# Altium project PCB_GREAT.PrjPCB
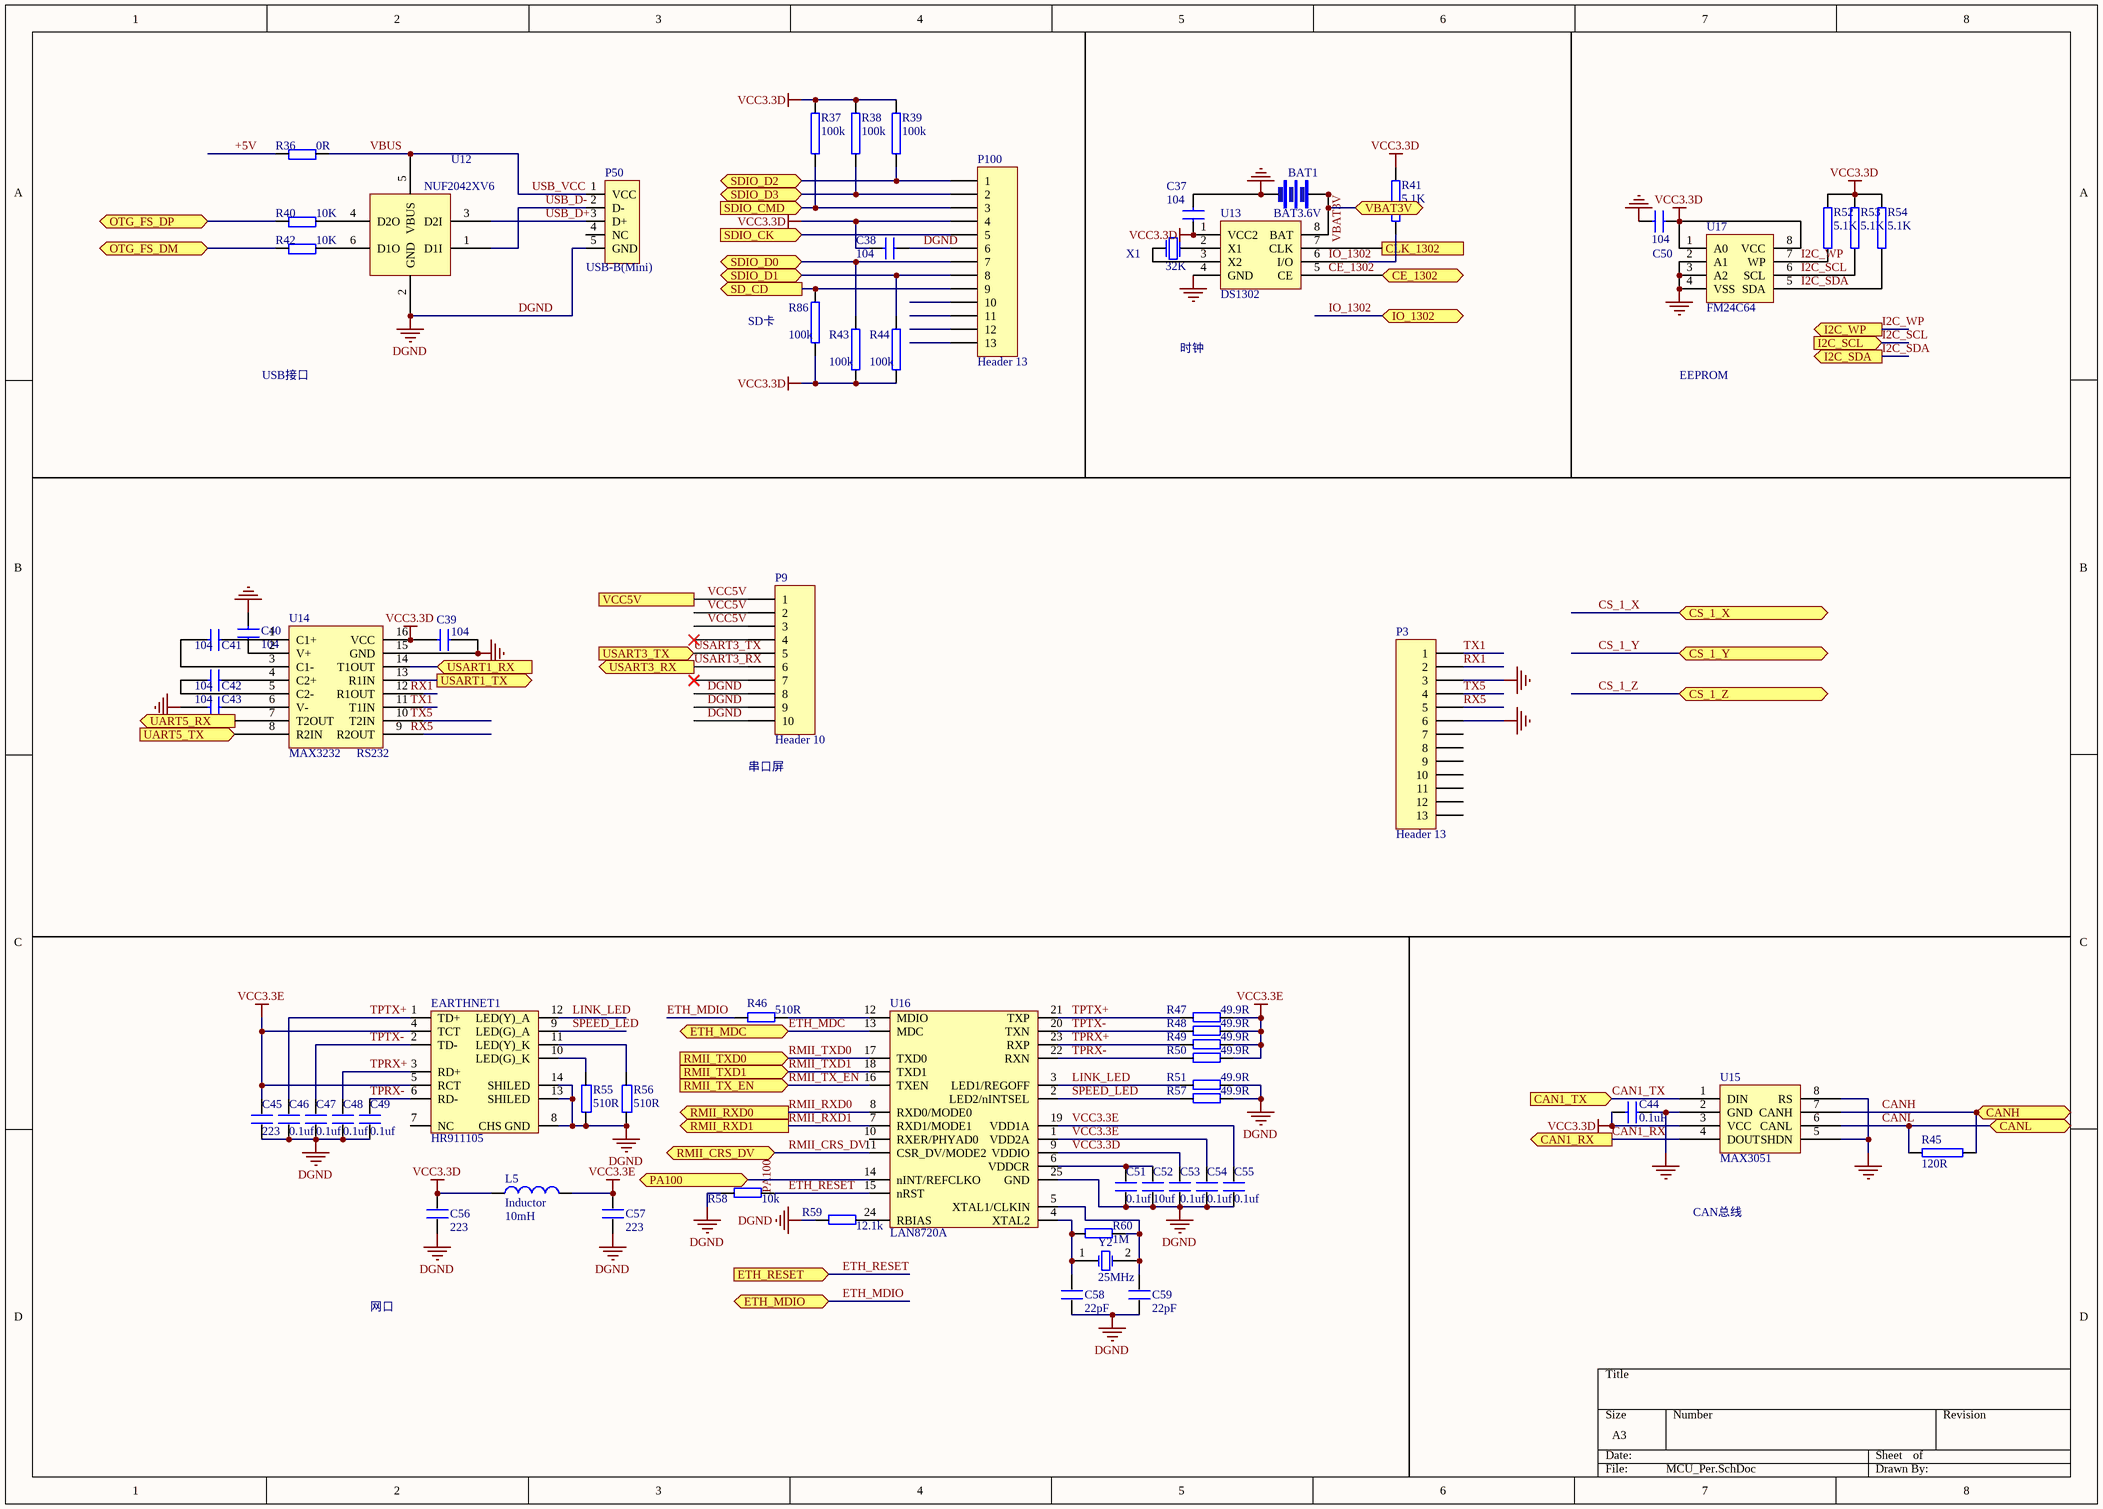
[diagram p0: MCU_Per.SchDoc]
4 sheets, 188 parts. Net scope: flat (ports and power ports of the same name join across sheets).
Board file: F_300.PcbDoc
Sheets:
  MCU_Per.SchDoc
  MCU_H.SchDoc
  IO_IIC.SchDoc
  Power.SchDoc

## Sheet MCU_Per.SchDoc
size A3

### Parts
BAT1  BAT3.6V  [BAT]
C37  104  [0603]
C38  104  [0603]
C39  104  [0603]
C40  104  [0603]
C41  104  [0603]
C42  104  [0603]
C43  104  [0603]
C44  0.1uF  [0603]
C45  223  [0603P]
C46  0.1uf  [0603P]
C47  0.1uf  [0603P]
C48  0.1uf  [0603P]
C49  0.1uf  [0603P]
C50  104  [0603]
C51  0.1uf  [0603P]
C52  10uf  [0603P]
C53  0.1uf  [0603P]
C54  0.1uf  [0603P]
C55  0.1uf  [0603P]
C56  223  [0603P]
C57  223  [0603P]
C58  22pF  [0603P]
C59  22pF  [0603P]
EARTHNET1  HR911105  [HR911105A]
L5  Inductor  value 10mH  [0805]
P3  Header 13  [HDR1X6]
P9  Header 10  [PCBComponent_1]
P50  USB-B(Mini)  [USB/SM0.8-6H5]
P100  Header 13  [SD-SMT]
R36  0R  [0603P]
R37  100k  [0603]
R38  100k  [0603]
R39  100k  [0603]
R40  10K  [0603P]
R41  5.1K  [0603]
R42  10K  [0603P]
R43  100k  [0603]
R44  100k  [0603]
R45  120R  [0603]
R46  510R  [0603P]
R47  49.9R  [0603P]
R48  49.9R  [0603P]
R49  49.9R  [0603P]
R50  49.9R  [0603P]
R51  49.9R  [0603P]
R52  5.1K  [0603]
R53  5.1K  [0603]
R54  5.1K  [0603]
R55  510R  [0603P]
R56  510R  [0603P]
R57  49.9R  [0603P]
R58  10k  [0603P]
R59  12.1k  [0603P]
R60  1M  [0603P]
R86  100k  [0603]
U12  NUF2042XV6  [NUF2042XV6]
U13  DS1302  [SO-8]
U14  MAX3232  [SO-16]
U15  MAX3051  [SO-8]
U16  LAN8720A  [LAN7820A-QFN24]
U17  FM24C64  [SO-8]
X1  32K  [XTAL-2]
Y2  25MHz  [XTAL_US]

### Ports
CAN1_RX (out), CAN1_TX (in), CANH, CANL, CE_1302 (bidir), CLK_1302, CS_1_X, CS_1_Y, CS_1_Z, ETH_MDC (bidir), ETH_MDIO (bidir), ETH_RESET (in), I2C_SCL (in), I2C_SDA (out), I2C_WP (out), IO_1302 (bidir), OTG_FS_DM (bidir), OTG_FS_DP (bidir), PA100, RMII_CRS_DV (bidir), RMII_RXD0 (out), RMII_RXD1 (out), RMII_TX_EN (in), RMII_TXD0 (in), RMII_TXD1 (in), SD_CD (out), SDIO_CK (in), SDIO_CMD (in), SDIO_D0 (bidir), SDIO_D1 (bidir), SDIO_D2 (bidir), SDIO_D3 (bidir), UART5_RX (out), UART5_TX (in), USART1_RX (in), USART1_TX (out), USART3_RX (out), USART3_TX (in), VBAT3V, VCC5V

### Nets
DGND: BAT1.2 C37.1 C38.1 C39.1 C40.1 C43.2 C44.1 C45.2 C46.2 C47.2 C48.2 C49.2 C50.2 C51.2 C52.2 C53.2 C54.2 C55.2 C56.2 C57.2 C58.2 C59.2 EARTHNET1.8(CHS_GND) EARTHNET1.13(SHILED) EARTHNET1.14(SHILED) P3.3 P3.6 P9.8 P9.9 P9.10 P50.5(GND) P100.6 R51.1 R55.1 R56.1 R57.1 R58.2 R59.2 U12.2(GND) U13.4(GND) U14.15(GND) U15.2(GND) U15.5(SHDN) U15.8(RS) U16.25(GND) U17.2(A1) U17.3(A2) U17.4(VSS)
VCC3.3D: C37.2 C38.2 C39.2 C44.2 C50.1 C53.1 C56.1 L5.1 P100.4 R37.1 R38.1 R39.1 R41.2 R43.2 R44.2 R52.2 R53.2 R54.2 R86.2 U13.1(VCC2) U14.16(VCC) U15.3(VCC) U16.9(VDDIO) U17.1(A0) U17.8(VCC)
VCC3.3E: C45.1 C54.1 C55.1 C57.1 EARTHNET1.4(TCT) EARTHNET1.5(RCT) L5.2 R47.1 R48.1 R49.1 R50.1 U16.1(VDD2A) U16.19(VDD1A)
+5V: R36.1
CAN1_RX: U15.4(DOUT) ; port CAN1_RX
CAN1_TX: U15.1(DIN) ; port CAN1_TX
CANH: R45.1 U15.7(CANH) ; port CANH
CANL: R45.2 U15.6(CANL) ; port CANL
CE_1302: U13.5(CE) ; port CE_1302
ETH_MDC: U16.13(MDC) ; port ETH_MDC
ETH_MDIO: R46.2 ; port ETH_MDIO
ETH_RESET: R58.1 U16.15(nRST) ; port ETH_RESET  [also labelled PA100]
I2C_SCL: R53.1 U17.6(SCL) ; port I2C_SCL
I2C_SDA: R54.1 U17.5(SDA) ; port I2C_SDA
I2C_WP: R52.1 U17.7(WP) ; port I2C_WP
IO_1302: R41.1 U13.6(I/O) ; port IO_1302
LINK_LED: EARTHNET1.12(LED(Y)_A) R51.2 U16.3(LED1/REGOFF)
PA9: U14.13(R1IN) ; port USART1_TX
PA11: R42.1 ; port OTG_FS_DM
PA12: R40.1 ; port OTG_FS_DP
PA100: U16.14(nINT/REFCLKO) ; port PA100
PB12: U14.8(R2IN) ; port UART5_TX
PB13: U14.7(T2OUT) ; port UART5_RX
PB15: U14.14(T1OUT) ; port USART1_RX
PC8: P100.7 R43.1 ; port SDIO_D0
PC9: P100.8 R44.1 ; port SDIO_D1
PC10: P100.1 R39.2 ; port SDIO_D2
PC11: P100.2 R38.2 ; port SDIO_D3
PC12: P100.5 ; port SDIO_CK
PD2: P100.3 R37.2 ; port SDIO_CMD
PH6: U13.7(CLK) ; port CLK_1302
RMII_CRS_DV: U16.11(CSR_DV/MODE2) ; port RMII_CRS_DV  [project net PA7]
RMII_RXD0: U16.8(RXD0/MODE0) ; port RMII_RXD0  [project net PC4]
RMII_RXD1: U16.7(RXD1/MODE1) ; port RMII_RXD1  [project net PC5]
RMII_TX_EN: U16.16(TXEN) ; port RMII_TX_EN  [project net PG11]
RMII_TXD0: U16.17(TXD0) ; port RMII_TXD0  [project net PG13]
RMII_TXD1: U16.18(TXD1) ; port RMII_TXD1  [project net PG14]
RX1: P3.2 U14.12(R1OUT)
RX5: P3.5 U14.9(R2OUT)
SPEED_LED: EARTHNET1.9(LED(G)_A) R57.2 U16.2(LED2/nINTSEL)
TPRX+: C48.1 EARTHNET1.3(RD+) R49.2 U16.23(RXP)
TPRX-: C49.1 EARTHNET1.6(RD-) R50.2 U16.22(RXN)
TPTX+: C46.1 EARTHNET1.1(TD+) R47.2 U16.21(TXP)
TPTX-: C47.1 EARTHNET1.2(TD-) R48.2 U16.20(TXN)
TX1: P3.1 U14.11(T1IN)
TX5: P3.4 U14.10(T2IN)
USART3_RX: P9.6 ; port USART3_RX  [project net PB11]
USART3_TX: P9.5 ; port USART3_TX  [project net PB10]
USB_D+: P50.3(D+) U12.3(D2I)
USB_D-: P50.2(D-) U12.1(D1I)
USB_VCC: P50.1(VCC) R36.2 U12.5(VBUS)  [also labelled VBUS]
VBAT3V: BAT1.1 U13.8(BAT) ; port VBAT3V
VCC5V: P9.1 P9.2 P9.3 ; port VCC5V
NetC40_2: C40.2 U14.2(V+)
NetC41_1: C41.1 U14.1(C1+)
NetC41_2: C41.2 U14.3(C1-)
NetC42_1: C42.1 U14.4(C2+)
NetC42_2: C42.2 U14.5(C2-)
NetC43_1: C43.1 U14.6(V-)
NetC51_1: C51.1 C52.1 U16.6(VDDCR)
NetC58_1: C58.1 R60.2 U16.4(XTAL2) Y2.1(OSC1)
NetC59_1: C59.1 R60.1 U16.5(XTAL1/CLKIN) Y2.2(OSC2)
NetEARTHNET1_10: EARTHNET1.10(LED(G)_K) R55.2
NetEARTHNET1_11: EARTHNET1.11(LED(Y)_K) R56.2
NetP100_9: P100.9 R86.1 ; port SD_CD
NetR40_2: R40.2 U12.4(D2O)
NetR42_2: R42.2 U12.6(D1O)
NetR46_1: R46.1 U16.12(MDIO)
NetR59_1: R59.1 U16.24(RBIAS)
NetU13_2: U13.2(X1) X1.2(P2)
NetU13_3: U13.3(X2) X1.1(P1)

Not connected (* = marked no-connect by the designer): EARTHNET1 7(NC); P3 7 8 9 10 11 12 13; P9 4* 7*; P50 4(NC); P100 10 11 12 13; U16 10(RXER/PHYAD0)

### Notes on the sheet
- USB接口
- (near R86) SD卡
- 时钟
- EEPROM
- (near U14) RS232
- (near P9) 串口屏
- CAN总线
- 网口

### Library data of the parts
C37-C59 = C
L5 = Inductor: Code_IEC: 1005; Published: 8-Jun-2000; LatestRevisionDate: 29-May-2009; LatestRevisionNote: IPC-7351 Footprint Added.; PackageReference: 0402-A; Publisher: Altium Limited; PackageDescription: Chip Inductor; Code_JEITA: 0402
P3 P100 = Header 13: Header, 13-Pin; LatestRevisionDate: 17-Jul-2002; LatestRevisionNote: Re-released for DXP Platform.; Publisher: Altium Limited
P9 = Header 10: Header, 10-Pin; LatestRevisionDate: 17-Jul-2002; LatestRevisionNote: Re-released for DXP Platform.; Publisher: Altium Limited
P50 = USB5
R36 R40 R42 R46-R51 R55-R60 = R
R37-R39 R41 R43-R45 R52-R54 R86 = RES
U12 = NUF2042XV6: USB
U15 = MAX3051: CAN
U16 = LAN8720: ETH PHY
X1 = XTAL
Y2 = XTAL: Crystal Oscillator; Published: 8-Jun-2000; LatestRevisionDate: 17-Jul-2002; LatestRevisionNote: Re-released for DXP Platform.; PackageReference: R38; Publisher: Altium Limited; PackageDescription: Crystal, Thru-Hole; 2 Leads; Body 3.1 x 8.2 mm (Dia.xH)

## Sheet MCU_H.SchDoc
size A3
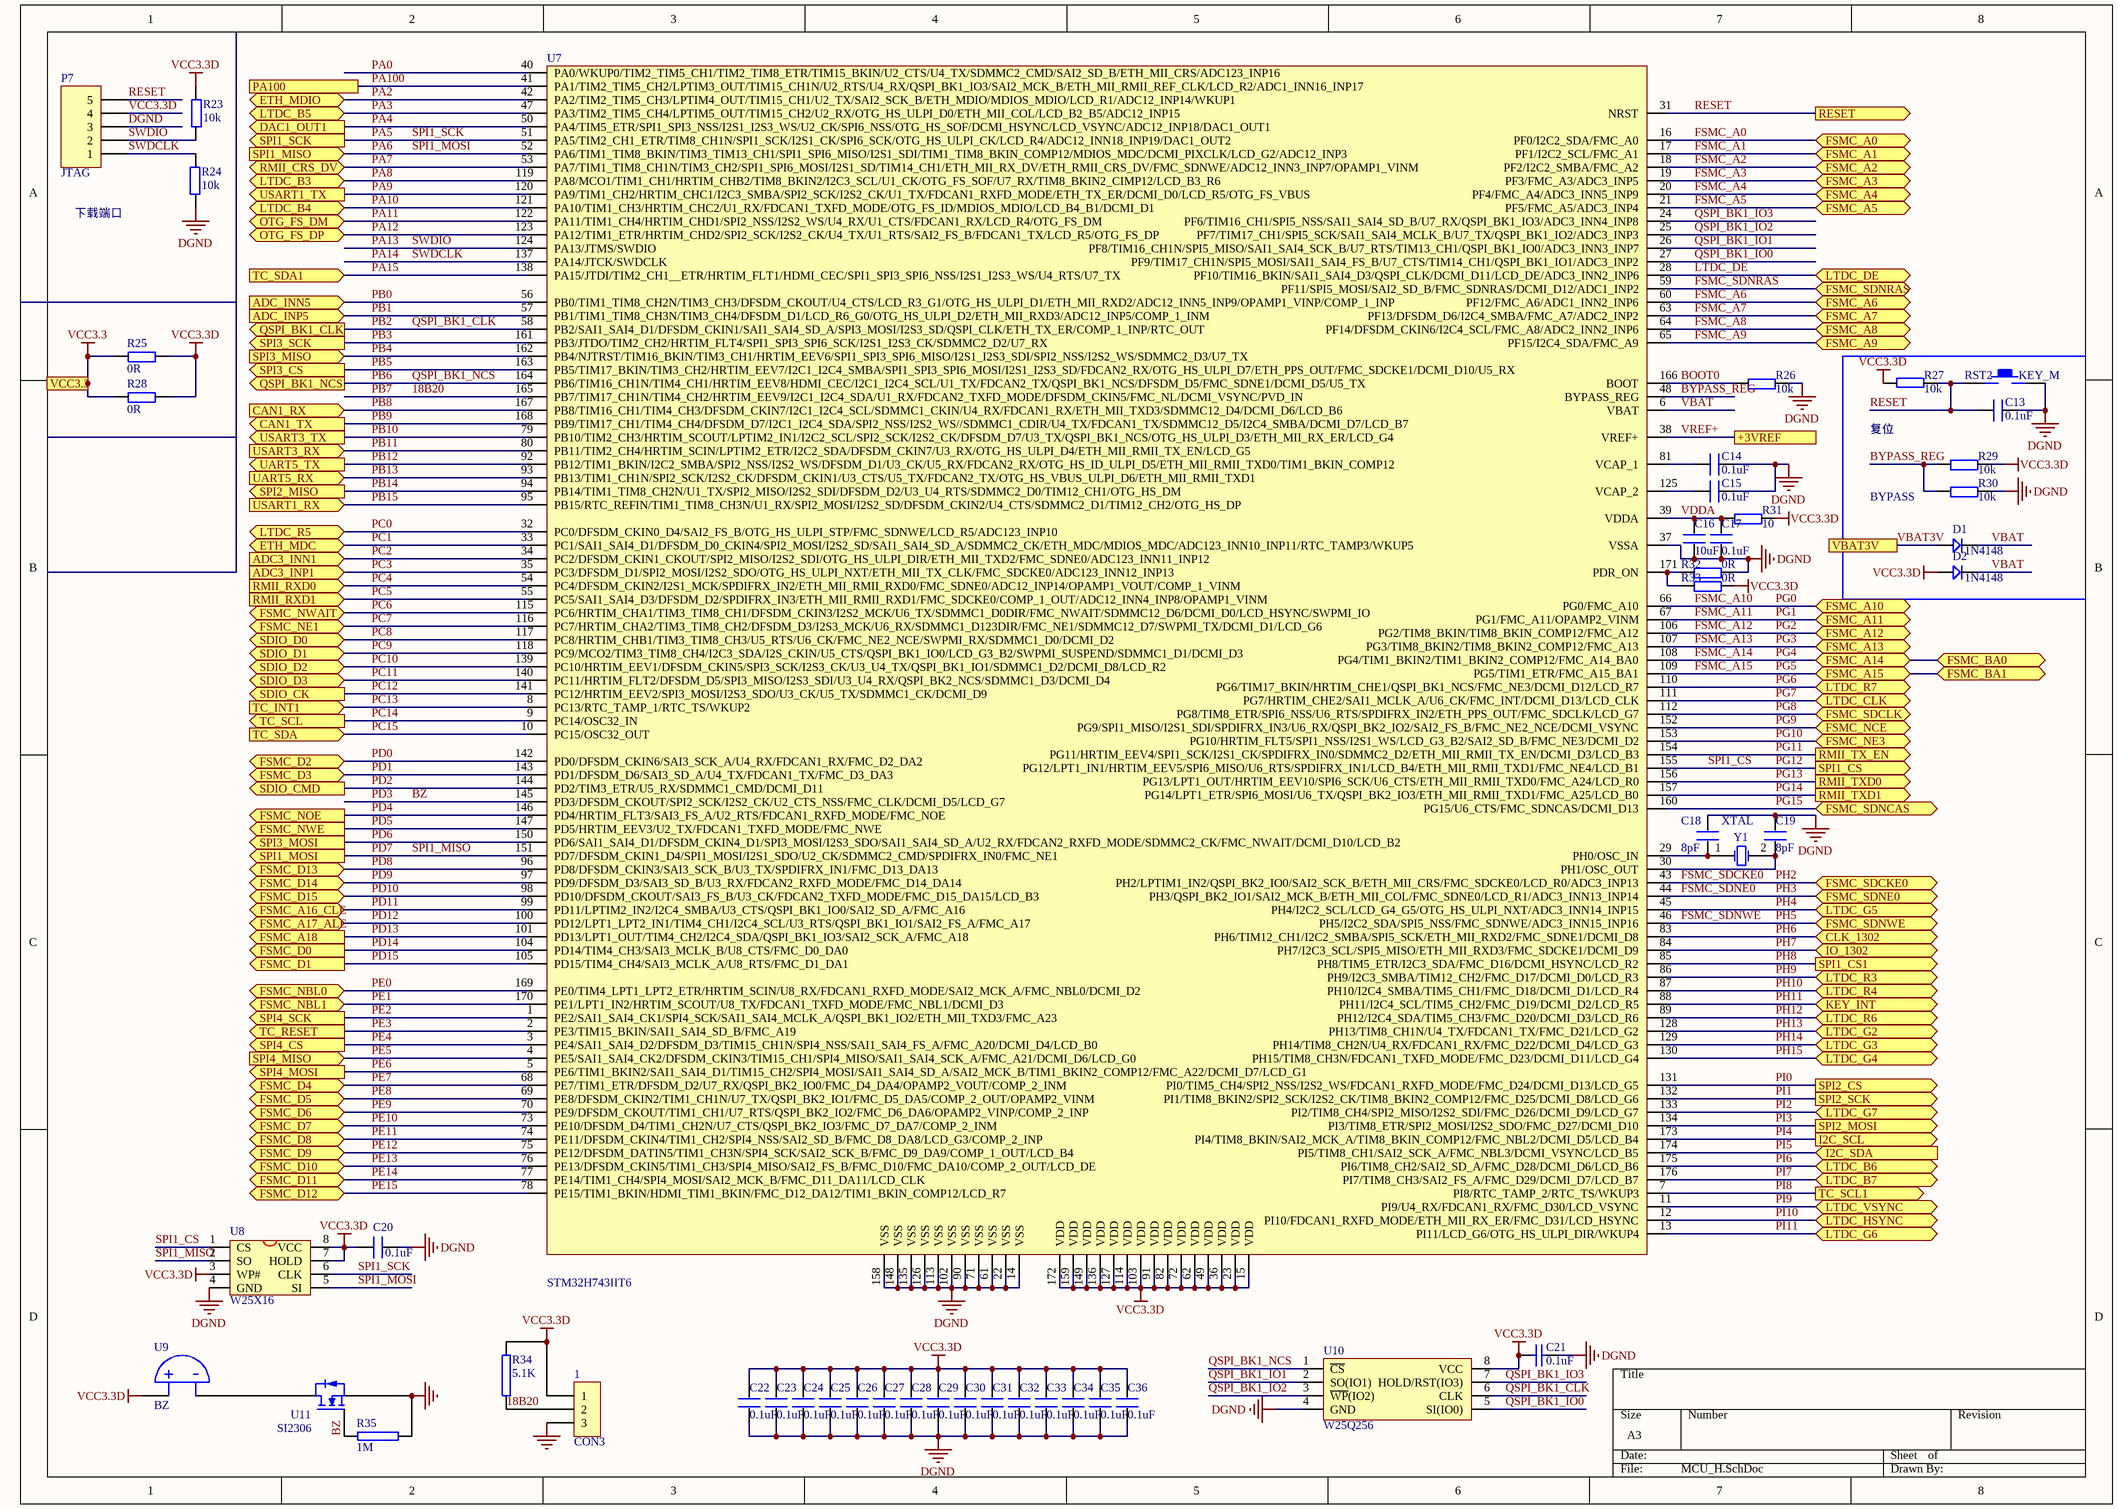
[diagram p1: MCU_H.SchDoc]

### Parts
1  CON3  [SIP3]
C13  0.1uF  [0603P]
C14  0.1uF  [0603P]
C15  0.1uF  [0603P]
C16  10uF  [0603P]
C17  0.1uF  [0603P]
C18  8pF  [0603P]
C19  8pF  [0603P]
C20  0.1uF  [0603P]
C21  0.1uF  [0603P]
C22  0.1uF  [0402]
C23  0.1uF  [0402]
C24  0.1uF  [0402]
C25  0.1uF  [0402]
C26  0.1uF  [0402]
C27  0.1uF  [0402]
C28  0.1uF  [0402]
C29  0.1uF  [0402]
C30  0.1uF  [0402]
C31  0.1uF  [0402]
C32  0.1uF  [0402]
C33  0.1uF  [0402]
C34  0.1uF  [0402]
C35  0.1uF  [0402]
C36  0.1uF  [0402]
D1  1N4148  [DIODE_SOP]
D2  1N4148  [DIODE_SOP]
P7  JTAG  [HDR1X5]
R23  10k  [0603P]
R24  10k  [0603P]
R25  0R  [0603P]
R26  10k  [0603P]
R27  10k  [0603P]
R28  0R  [0603P]
R29  10k  [0603P]
R30  10k  [0603P]
R31  10  [0603P]
R32  0R  [0603P]
R33  0R  [0603P]
R34  5.1K  [0603]
R35  1M  [0603]
RST2  KEY_M  [KEY_SOP3625]
U7  STM32H743IIT6  [STM32h743IIGT-NEW-LQFN-176N]
U8  W25X16  [SOIC-8]
U9  BZ  [BZ_SMALL]
U10  W25Q256  [WSON8]
U11  SI2306  [SOT-23]
Y1  XTAL  [XTAL1]

### Ports
+3VREF, ADC3_INN1 (in), ADC3_INP1 (in), ADC_INN5 (in), ADC_INP5 (in), CAN1_RX (in), CAN1_TX (out), CLK_1302 (bidir), DAC1_OUT1 (out), ETH_MDC (bidir), ETH_MDIO (bidir), FSMC_A0 (bidir), FSMC_A1 (bidir), FSMC_A2 (bidir), FSMC_A3 (bidir), FSMC_A4 (bidir), FSMC_A5 (bidir), FSMC_A6 (bidir), FSMC_A7 (bidir), FSMC_A8 (bidir), FSMC_A9 (bidir), FSMC_A10 (bidir), FSMC_A11 (bidir), FSMC_A12 (bidir), FSMC_A13 (bidir), FSMC_A14 (bidir), FSMC_A15 (bidir), FSMC_A16_CLE (bidir), FSMC_A17_ALE (bidir), FSMC_A18 (out), FSMC_BA0 (bidir), FSMC_BA1 (bidir), FSMC_D0 (out), FSMC_D1 (out), FSMC_D2 (bidir), FSMC_D3 (bidir), FSMC_D4 (bidir), FSMC_D5 (bidir), FSMC_D6 (bidir), FSMC_D7 (bidir), FSMC_D8 (bidir), FSMC_D9 (bidir), FSMC_D10 (bidir), FSMC_D11 (bidir), FSMC_D12 (bidir), FSMC_D13 (bidir), FSMC_D14 (bidir), FSMC_D15 (bidir), FSMC_NBL0 (bidir), FSMC_NBL1 (bidir), FSMC_NCE (bidir), FSMC_NE1 (bidir), FSMC_NE3 (bidir), FSMC_NOE (out), FSMC_NWAIT (bidir), FSMC_NWE (out), FSMC_SDCKE0 (bidir), FSMC_SDCLK (bidir), FSMC_SDNCAS (bidir), FSMC_SDNE0 (bidir), FSMC_SDNRAS (bidir), FSMC_SDNWE (bidir), I2C_SCL (out), I2C_SDA (in), IO_1302 (bidir), KEY_INT (bidir), LTDC_B3 (bidir), LTDC_B4 (bidir), LTDC_B5 (bidir), LTDC_B6 (bidir), LTDC_B7 (bidir), LTDC_CLK (bidir), LTDC_DE (bidir), LTDC_G2 (bidir), LTDC_G3 (bidir), LTDC_G4 (bidir), LTDC_G5 (bidir), LTDC_G6 (bidir), LTDC_G7 (bidir), LTDC_HSYNC (bidir), LTDC_R3 (bidir), LTDC_R4 (bidir), LTDC_R5 (bidir), LTDC_R6 (bidir), LTDC_R7 (bidir), LTDC_VSYNC (bidir), OTG_FS_DM (bidir), OTG_FS_DP (bidir), PA100, QSPI_BK1_CLK (out), QSPI_BK1_NCS (out), RESET (out), RMII_CRS_DV (bidir), RMII_RXD0 (in), RMII_RXD1 (in), RMII_TX_EN (out), RMII_TXD0 (out), RMII_TXD1 (out), SDIO_CK (out), SDIO_CMD (out), SDIO_D0 (bidir), SDIO_D1 (bidir), SDIO_D2 (bidir), SDIO_D3 (bidir), SPI1_CS1 (out), SPI1_CS (out), SPI1_MISO (in), SPI1_MOSI (out), SPI1_SCK (out), SPI2_CS (out), SPI2_MISO (out), SPI2_MOSI (out), SPI2_SCK (out), SPI3_CS (out), SPI3_MISO (in), SPI3_MOSI (out), SPI3_SCK (out), SPI4_CS (out), SPI4_MISO (in), SPI4_MOSI (out), SPI4_SCK (out), TC_INT1 (in), TC_RESET (out), TC_SCL1 (out), TC_SCL (out), TC_SDA1 (in), TC_SDA (in), UART5_RX (in), UART5_TX (out), USART1_RX (in), USART1_TX (out), USART3_RX (in), USART3_TX (out), VBAT3V, VCC3.3

### Nets
DGND: 1.3 C13.2 C14.2 C15.2 C16.1 C17.1 C18.2 C19.2 C20.2 C21.1 C22.1 C23.1 C24.1 C25.1 C26.1 C27.1 C28.1 C29.1 C30.1 C31.1 C32.1 C33.1 C34.1 C35.1 C36.1 P7.3 R24.2 R26.2 R30.2 R32.2 R35.1 RST2.2 U7.14(VSS) U7.22(VSS) U7.37(VSSA) U7.61(VSS) U7.71(VSS) U7.90(VSS) U7.102(VSS) U7.113(VSS) U7.126(VSS) U7.135(VSS) U7.148(VSS) U7.158(VSS) U8.4(GND) U10.4(GND) U11.E
VCC3.3: R25.1 R28.1 ; port VCC3.3
VCC3.3D: 1.1 C20.1 C21.2 C22.2 C23.2 C24.2 C25.2 C26.2 C27.2 C28.2 C29.2 C30.2 C31.2 C32.2 C33.2 C34.2 C35.2 C36.2 D2.1 P7.4 R23.2 R25.2 R27.2 R28.2 R29.2 R31.2 R33.2 R34.2 U7.15(VDD) U7.23(VDD) U7.36(VDD) U7.49(VDD) U7.62(VDD) U7.72(VDD) U7.82(VDD) U7.91(VDD) U7.103(VDD) U7.114(VDD) U7.127(VDD) U7.136(VDD) U7.149(VDD) U7.159(VDD) U7.172(VDD) U8.3(WP#) U8.7(HOLD) U8.8(VCC) U9.1 U10.8(VCC)
VREF+: U7.38(VREF+) ; port +3VREF
18B20: 1.2 R34.1 U7.165(PB7/TIM17_CH1N/TIM4_CH2/HRTIM_EEV9/I2C1_I2C4_SDA/U1_RX/FDCAN2_TXFD_MODE/DFSDM_CKIN5/FMC_NL/DCMI_VSYNC/PVD_IN)  [also labelled PB7]
BOOT0: R26.1 U7.166(BOOT)
BYPASS_REG: R29.1 R30.1 U7.48(BYPASS_REG)
BZ: R35.2 U7.145(PD3/DFSDM_CKOUT/SPI2_SCK/I2S2_CK/U2_CTS_NSS/FMC_CLK/DCMI_D5/LCD_G7) U11.B  [also labelled PD3]
FSMC_A0: U7.16(PF0/I2C2_SDA/FMC_A0) ; port FSMC_A0
FSMC_A1: U7.17(PF1/I2C2_SCL/FMC_A1) ; port FSMC_A1
FSMC_A2: U7.18(PF2/I2C2_SMBA/FMC_A2) ; port FSMC_A2
FSMC_A3: U7.19(PF3/FMC_A3/ADC3_INP5) ; port FSMC_A3
FSMC_A4: U7.20(PF4/FMC_A4/ADC3_INN5_INP9) ; port FSMC_A4
FSMC_A5: U7.21(PF5/FMC_A5/ADC3_INP4) ; port FSMC_A5
FSMC_A6: U7.60(PF12/FMC_A6/ADC1_INN2_INP6) ; port FSMC_A6
FSMC_A7: U7.63(PF13/DFSDM_D6/I2C4_SMBA/FMC_A7/ADC2_INP2) ; port FSMC_A7
FSMC_A8: U7.64(PF14/DFSDM_CKIN6/I2C4_SCL/FMC_A8/ADC2_INN2_INP6) ; port FSMC_A8
FSMC_A9: U7.65(PF15/I2C4_SDA/FMC_A9) ; port FSMC_A9
FSMC_A10: U7.66(PG0/FMC_A10) ; port FSMC_A10  [also labelled PG0]
FSMC_A11: U7.67(PG1/FMC_A11/OPAMP2_VINM) ; port FSMC_A11  [also labelled PG1]
FSMC_A12: U7.106(PG2/TIM8_BKIN/TIM8_BKIN_COMP12/FMC_A12) ; port FSMC_A12  [also labelled PG2]
FSMC_A13: U7.107(PG3/TIM8_BKIN2/TIM8_BKIN2_COMP12/FMC_A13) ; port FSMC_A13  [also labelled PG3]
FSMC_A14: U7.108(PG4/TIM1_BKIN2/TIM1_BKIN2_COMP12/FMC_A14_BA0) ; port FSMC_A14, port FSMC_BA0  [also labelled PG4]
FSMC_A15: U7.109(PG5/TIM1_ETR/FMC_A15_BA1) ; port FSMC_A15, port FSMC_BA1  [also labelled PG5]
FSMC_SDCKE0: U7.43(PH2/LPTIM1_IN2/QSPI_BK2_IO0/SAI2_SCK_B/ETH_MII_CRS/FMC_SDCKE0/LCD_R0/ADC3_INP13) ; port FSMC_SDCKE0  [also labelled PH2]
FSMC_SDNE0: U7.44(PH3/QSPI_BK2_IO1/SAI2_MCK_B/ETH_MII_COL/FMC_SDNE0/LCD_R1/ADC3_INN13_INP14) ; port FSMC_SDNE0  [also labelled PH3]
FSMC_SDNRAS: U7.59(PF11/SPI5_MOSI/SAI2_SD_B/FMC_SDNRAS/DCMI_D12/ADC1_INP2) ; port FSMC_SDNRAS
FSMC_SDNWE: U7.46(PH5/I2C2_SDA/SPI5_NSS/FMC_SDNWE/ADC3_INN15_INP16) ; port FSMC_SDNWE  [also labelled PH5]
LTDC_DE: U7.28(PF10/TIM16_BKIN/SAI1_SAI4_D3/QSPI_CLK/DCMI_D11/LCD_DE/ADC3_INN2_INP6) ; port LTDC_DE
PA0: U7.40(PA0/WKUP0/TIM2_TIM5_CH1/TIM2_TIM8_ETR/TIM15_BKIN/U2_CTS/U4_TX/SDMMC2_CMD/SAI2_SD_B/ETH_MII_CRS/ADC123_INP16)
PA2: U7.42(PA2/TIM2_TIM5_CH3/LPTIM4_OUT/TIM15_CH1/U2_TX/SAI2_SCK_B/ETH_MDIO/MDIOS_MDIO/LCD_R1/ADC12_INP14/WKUP1) ; port ETH_MDIO  [project net ETH_MDIO]
PA3: U7.47(PA3/TIM2_TIM5_CH4/LPTIM5_OUT/TIM15_CH2/U2_RX/OTG_HS_ULPI_D0/ETH_MII_COL/LCD_B2_B5/ADC12_INP15) ; port LTDC_B5
PA4: U7.50(PA4/TIM5_ETR/SPI1_SPI3_NSS/I2S1_I2S3_WS/U2_CK/SPI6_NSS/OTG_HS_SOF/DCMI_HSYNC/LCD_VSYNC/ADC12_INP18/DAC1_OUT1) ; port DAC1_OUT1  [project net DAC1_OUT1]
PA5: U7.51(PA5/TIM2_CH1_ETR/TIM8_CH1N/SPI1_SCK/I2S1_CK/SPI6_SCK/OTG_HS_ULPI_CK/LCD_R4/ADC12_INN18_INP19/DAC1_OUT2) U8.6(CLK) ; port SPI1_SCK  [also labelled SPI1_SCK]
PA6: U7.52(PA6/TIM1_TIM8_BKIN/TIM3_TIM13_CH1/SPI1_SPI6_MISO/I2S1_SDI/TIM1_TIM8_BKIN_COMP12/MDIOS_MDC/DCMI_PIXCLK/LCD_G2/ADC12_INP3) U8.5(SI) ; port SPI1_MISO  [also labelled SPI1_MOSI]
PA7: U7.53(PA7/TIM1_TIM8_CH1N/TIM3_CH2/SPI1_SPI6_MOSI/I2S1_SD/TIM14_CH1/ETH_MII_RX_DV/ETH_RMII_CRS_DV/FMC_SDNWE/ADC12_INN3_INP7/OPAMP1_VINM) ; port RMII_CRS_DV
PA8: U7.119(PA8/MCO1/TIM1_CH1/HRTIM_CHB2/TIM8_BKIN2/I2C3_SCL/U1_CK/OTG_FS_SOF/U7_RX/TIM8_BKIN2_CIMP12/LCD_B3_R6) ; port LTDC_B3
PA9: U7.120(PA9/TIM1_CH2/HRTIM_CHC1/I2C3_SMBA/SPI2_SCK/I2S2_CK/U1_TX/FDCAN1_RXFD_MODE/ETH_TX_ER/DCMI_D0/LCD_R5/OTG_FS_VBUS) ; port USART1_TX
PA10: U7.121(PA10/TIM1_CH3/HRTIM_CHC2/U1_RX/FDCAN1_TXFD_MODE/OTG_FS_ID/MDIOS_MDIO/LCD_B4_B1/DCMI_D1) ; port LTDC_B4
PA11: U7.122(PA11/TIM1_CH4/HRTIM_CHD1/SPI2_NSS/I2S2_WS/U4_RX/U1_CTS/FDCAN1_RX/LCD_R4/OTG_FS_DM) ; port OTG_FS_DM
PA12: U7.123(PA12/TIM1_ETR/HRTIM_CHD2/SPI2_SCK/I2S2_CK/U4_TX/U1_RTS/SAI2_FS_B/FDCAN1_TX/LCD_R5/OTG_FS_DP) ; port OTG_FS_DP
PA13: P7.2 R23.1 U7.124(PA13/JTMS/SWDIO)  [also labelled SWDIO]
PA14: P7.1 R24.1 U7.137(PA14/JTCK/SWDCLK)  [also labelled SWDCLK]
PA15: U7.138(PA15/JTDI/TIM2_CH1__ETR/HRTIM_FLT1/HDMI_CEC/SPI1_SPI3_SPI6_NSS/I2S1_I2S3_WS/U4_RTS/U7_TX) ; port TC_SDA1
PA100: U7.41(PA1/TIM2_TIM5_CH2/LPTIM3_OUT/TIM15_CH1N/U2_RTS/U4_RX/QSPI_BK1_IO3/SAI2_MCK_B/ETH_MII_RMII_REF_CLK/LCD_R2/ADC1_INN16_INP17) ; port PA100
PB0: U7.56(PB0/TIM1_TIM8_CH2N/TIM3_CH3/DFSDM_CKOUT/U4_CTS/LCD_R3_G1/OTG_HS_ULPI_D1/ETH_MII_RXD2/ADC12_INN5_INP9/OPAMP1_VINP/COMP_1_INP) ; port ADC_INN5
PB1: U7.57(PB1/TIM1_TIM8_CH3N/TIM3_CH4/DFSDM_D1/LCD_R6_G0/OTG_HS_ULPI_D2/ETH_MII_RXD3/ADC12_INP5/COMP_1_INM) ; port ADC_INP5
PB2: U7.58(PB2/SAI1_SAI4_D1/DFSDM_CKIN1/SAI1_SAI4_SD_A/SPI3_MOSI/I2S3_SD/QSPI_CLK/ETH_TX_ER/COMP_1_INP/RTC_OUT) U10.6(CLK) ; port QSPI_BK1_CLK  [also labelled QSPI_BK1_CLK]
PB3: U7.161(PB3/JTDO/TIM2_CH2/HRTIM_FLT4/SPI1_SPI3_SPI6_SCK/I2S1_I2S3_CK/SDMMC2_D2/U7_RX) ; port SPI3_SCK
PB4: U7.162(PB4/NJTRST/TIM16_BKIN/TIM3_CH1/HRTIM_EEV6/SPI1_SPI3_SPI6_MISO/I2S1_I2S3_SDI/SPI2_NSS/I2S2_WS/SDMMC2_D3/U7_TX) ; port SPI3_MISO
PB5: U7.163(PB5/TIM17_BKIN/TIM3_CH2/HRTIM_EEV7/I2C1_I2C4_SMBA/SPI1_SPI3_SPI6_MOSI/I2S1_I2S3_SD/FDCAN2_RX/OTG_HS_ULPI_D7/ETH_PPS_OUT/FMC_SDCKE1/DCMI_D10/U5_RX) ; port SPI3_CS
PB6: U7.164(PB6/TIM16_CH1N/TIM4_CH1/HRTIM_EEV8/HDMI_CEC/I2C1_I2C4_SCL/U1_TX/FDCAN2_TX/QSPI_BK1_NCS/DFSDM_D5/FMC_SDNE1/DCMI_D5/U5_TX) U10.1(~{CS}) ; port QSPI_BK1_NCS  [also labelled QSPI_BK1_NCS]
PB8: U7.167(PB8/TIM16_CH1/TIM4_CH3/DFSDM_CKIN7/I2C1_I2C4_SCL/SDMMC1_CKIN/U4_RX/FDCAN1_RX/ETH_MII_TXD3/SDMMC12_D4/DCMI_D6/LCD_B6) ; port CAN1_RX  [project net CAN1_RX]
PB9: U7.168(PB9/TIM17_CH1/TIM4_CH4/DFSDM_D7/I2C1_I2C4_SDA/SPI2_NSS/I2S2_WS//SDMMC1_CDIR/U4_TX/FDCAN1_TX/SDMMC12_D5/I2C4_SMBA/DCMI_D7/LCD_B7) ; port CAN1_TX  [project net CAN1_TX]
PB10: U7.79(PB10/TIM2_CH3/HRTIM_SCOUT/LPTIM2_IN1/I2C2_SCL/SPI2_SCK/I2S2_CK/DFSDM_D7/U3_TX/QSPI_BK1_NCS/OTG_HS_ULPI_D3/ETH_MII_RX_ER/LCD_G4) ; port USART3_TX
PB11: U7.80(PB11/TIM2_CH4/HRTIM_SCIN/LPTIM2_ETR/I2C2_SDA/DFSDM_CKIN7/U3_RX/OTG_HS_ULPI_D4/ETH_MII_RMII_TX_EN/LCD_G5) ; port USART3_RX
PB12: U7.92(PB12/TIM1_BKIN/I2C2_SMBA/SPI2_NSS/I2S2_WS/DFSDM_D1/U3_CK/U5_RX/FDCAN2_RX/OTG_HS_ID_ULPI_D5/ETH_MII_RMII_TXD0/TIM1_BKIN_COMP12) ; port UART5_TX
PB13: U7.93(PB13/TIM1_CH1N/SPI2_SCK/I2S2_CK/DFSDM_CKIN1/U3_CTS/U5_TX/FDCAN2_TX/OTG_HS_VBUS_ULPI_D6/ETH_MII_RMII_TXD1) ; port UART5_RX
PB14: U7.94(PB14/TIM1_TIM8_CH2N/U1_TX/SPI2_MISO/I2S2_SDI/DFSDM_D2/U3_U4_RTS/SDMMC2_D0/TIM12_CH1/OTG_HS_DM) ; port SPI2_MISO
PB15: U7.95(PB15/RTC_REFIN/TIM1_TIM8_CH3N/U1_RX/SPI2_MOSI/I2S2_SD/DFSDM_CKIN2/U4_CTS/SDMMC2_D1/TIM12_CH2/OTG_HS_DP) ; port USART1_RX
PC0: U7.32(PC0/DFSDM_CKIN0_D4/SAI2_FS_B/OTG_HS_ULPI_STP/FMC_SDNWE/LCD_R5/ADC123_INP10) ; port LTDC_R5
PC1: U7.33(PC1/SAI1_SAI4_D1/DFSDM_D0_CKIN4/SPI2_MOSI/I2S2_SD/SAI1_SAI4_SD_A/SDMMC2_CK/ETH_MDC/MDIOS_MDC/ADC123_INN10_INP11/RTC_TAMP3/WKUP5) ; port ETH_MDC  [project net ETH_MDC]
PC2: U7.34(PC2/DFSDM_CKIN1_CKOUT/SPI2_MISO/I2S2_SDI/OTG_HS_ULPI_DIR/ETH_MII_TXD2/FMC_SDNE0/ADC123_INN11_INP12) ; port ADC3_INN1
PC3: U7.35(PC3/DFSDM_D1/SPI2_MOSI/I2S2_SDO/OTG_HS_ULPI_NXT/ETH_MII_TX_CLK/FMC_SDCKE0/ADC123_INN12_INP13) ; port ADC3_INP1
PC4: U7.54(PC4/DFSDM_CKIN2/I2S1_MCK/SPDIFRX_IN2/ETH_MII_RMII_RXD0/FMC_SDNE0/ADC12_INP14/OPAMP1_VOUT/COMP_1_VINM) ; port RMII_RXD0
PC5: U7.55(PC5/SAI1_SAI4_D3/DFSDM_D2/SPDIFRX_IN3/ETH_MII_RMII_RXD1/FMC_SDCKE0/COMP_1_OUT/ADC12_INN4_INP8/OPAMP1_VINM) ; port RMII_RXD1
PC6: U7.115(PC6/HRTIM_CHA1/TIM3_TIM8_CH1/DFSDM_CKIN3/I2S2_MCK/U6_TX/SDMMC1_D0DIR/FMC_NWAIT/SDMMC12_D6/DCMI_D0/LCD_HSYNC/SWPMI_IO) ; port FSMC_NWAIT
PC7: U7.116(PC7/HRTIM_CHA2/TIM3_TIM8_CH2/DFSDM_D3/I2S3_MCK/U6_RX/SDMMC1_D123DIR/FMC_NE1/SDMMC12_D7/SWPMI_TX/DCMI_D1/LCD_G6) ; port FSMC_NE1
PC8: U7.117(PC8/HRTIM_CHB1/TIM3_TIM8_CH3/U5_RTS/U6_CK/FMC_NE2_NCE/SWPMI_RX/SDMMC1_D0/DCMI_D2) ; port SDIO_D0
PC9: U7.118(PC9/MCO2/TIM3_TIM8_CH4/I2C3_SDA/I2S_CKIN/U5_CTS/QSPI_BK1_IO0/LCD_G3_B2/SWPMI_SUSPEND/SDMMC1_D1/DCMI_D3) ; port SDIO_D1
PC10: U7.139(PC10/HRTIM_EEV1/DFSDM_CKIN5/SPI3_SCK/I2S3_CK/U3_U4_TX/QSPI_BK1_IO1/SDMMC1_D2/DCMI_D8/LCD_R2) ; port SDIO_D2
PC11: U7.140(PC11/HRTIM_FLT2/DFSDM_D5/SPI3_MISO/I2S3_SDI/U3_U4_RX/QSPI_BK2_NCS/SDMMC1_D3/DCMI_D4) ; port SDIO_D3
PC12: U7.141(PC12/HRTIM_EEV2/SPI3_MOSI/I2S3_SDO/U3_CK/U5_TX/SDMMC1_CK/DCMI_D9) ; port SDIO_CK
PC13: U7.8(PC13/RTC_TAMP_1/RTC_TS/WKUP2) ; port TC_INT1
PC14: U7.9(PC14/OSC32_IN) ; port TC_SCL
PC15: U7.10(PC15/OSC32_OUT) ; port TC_SDA
PD0: U7.142(PD0/DFSDM_CKIN6/SAI3_SCK_A/U4_RX/FDCAN1_RX/FMC_D2_DA2) ; port FSMC_D2
PD1: U7.143(PD1/DFSDM_D6/SAI3_SD_A/U4_TX/FDCAN1_TX/FMC_D3_DA3) ; port FSMC_D3
PD2: U7.144(PD2/TIM3_ETR/U5_RX/SDMMC1_CMD/DCMI_D11) ; port SDIO_CMD
PD4: U7.146(PD4/HRTIM_FLT3/SAI3_FS_A/U2_RTS/FDCAN1_RXFD_MODE/FMC_NOE) ; port FSMC_NOE
PD5: U7.147(PD5/HRTIM_EEV3/U2_TX/FDCAN1_TXFD_MODE/FMC_NWE) ; port FSMC_NWE
PD6: U7.150(PD6/SAI1_SAI4_D1/DFSDM_CKIN4_D1/SPI3_MOSI/I2S3_SDO/SAI1_SAI4_SD_A/U2_RX/FDCAN2_RXFD_MODE/SDMMC2_CK/FMC_NWAIT/DCMI_D10/LCD_B2) ; port SPI3_MOSI
PD7: U7.151(PD7/DFSDM_CKIN1_D4/SPI1_MOSI/I2S1_SDO/U2_CK/SDMMC2_CMD/SPDIFRX_IN0/FMC_NE1) U8.2(SO) ; port SPI1_MOSI  [also labelled SPI1_MISO]
PD8: U7.96(PD8/DFSDM_CKIN3/SAI3_SCK_B/U3_TX/SPDIFRX_IN1/FMC_D13_DA13) ; port FSMC_D13
PD9: U7.97(PD9/DFSDM_D3/SAI3_SD_B/U3_RX/FDCAN2_RXFD_MODE/FMC_D14_DA14) ; port FSMC_D14
PD10: U7.98(PD10/DFSDM_CKOUT/SAI3_FS_B/U3_CK/FDCAN2_TXFD_MODE/FMC_D15_DA15/LCD_B3) ; port FSMC_D15
PD11: U7.99(PD11/LPTIM2_IN2/I2C4_SMBA/U3_CTS/QSPI_BK1_IO0/SAI2_SD_A/FMC_A16) ; port FSMC_A16_CLE
PD12: U7.100(PD12/LPT1_LPT2_IN1/TIM4_CH1/I2C4_SCL/U3_RTS/QSPI_BK1_IO1/SAI2_FS_A/FMC_A17) ; port FSMC_A17_ALE
PD13: U7.101(PD13/LPT1_OUT/TIM4_CH2/I2C4_SDA/QSPI_BK1_IO3/SAI2_SCK_A/FMC_A18) ; port FSMC_A18
PD14: U7.104(PD14/TIM4_CH3/SAI3_MCLK_B/U8_CTS/FMC_D0_DA0) ; port FSMC_D0
PD15: U7.105(PD15/TIM4_CH4/SAI3_MCLK_A/U8_RTS/FMC_D1_DA1) ; port FSMC_D1
PE0: U7.169(PE0/TIM4_LPT1_LPT2_ETR/HRTIM_SCIN/U8_RX/FDCAN1_RXFD_MODE/SAI2_MCK_A/FMC_NBL0/DCMI_D2) ; port FSMC_NBL0
PE1: U7.170(PE1/LPT1_IN2/HRTIM_SCOUT/U8_TX/FDCAN1_TXFD_MODE/FMC_NBL1/DCMI_D3) ; port FSMC_NBL1
PE2: U7.1(PE2/SAI1_SAI4_CK1/SPI4_SCK/SAI1_SAI4_MCLK_A/QSPI_BK1_IO2/ETH_MII_TXD3/FMC_A23) ; port SPI4_SCK
PE3: U7.2(PE3/TIM15_BKIN/SAI1_SAI4_SD_B/FMC_A19) ; port TC_RESET
PE4: U7.3(PE4/SAI1_SAI4_D2/DFSDM_D3/TIM15_CH1N/SPI4_NSS/SAI1_SAI4_FS_A/FMC_A20/DCMI_D4/LCD_B0) ; port SPI4_CS
PE5: U7.4(PE5/SAI1_SAI4_CK2/DFSDM_CKIN3/TIM15_CH1/SPI4_MISO/SAI1_SAI4_SCK_A/FMC_A21/DCMI_D6/LCD_G0) ; port SPI4_MISO
PE6: U7.5(PE6/TIM1_BKIN2/SAI1_SAI4_D1/TIM15_CH2/SPI4_MOSI/SAI1_SAI4_SD_A/SAI2_MCK_B/TIM1_BKIN2_COMP12/FMC_A22/DCMI_D7/LCD_G1) ; port SPI4_MOSI
PE7: U7.68(PE7/TIM1_ETR/DFSDM_D2/U7_RX/QSPI_BK2_IO0/FMC_D4_DA4/OPAMP2_VOUT/COMP_2_INM) ; port FSMC_D4
PE8: U7.69(PE8/DFSDM_CKIN2/TIM1_CH1N/U7_TX/QSPI_BK2_IO1/FMC_D5_DA5/COMP_2_OUT/OPAMP2_VINM) ; port FSMC_D5
PE9: U7.70(PE9/DFSDM_CKOUT/TIM1_CH1/U7_RTS/QSPI_BK2_IO2/FMC_D6_DA6/OPAMP2_VINP/COMP_2_INP) ; port FSMC_D6
PE10: U7.73(PE10/DFSDM_D4/TIM1_CH2N/U7_CTS/QSPI_BK2_IO3/FMC_D7_DA7/COMP_2_INM) ; port FSMC_D7
PE11: U7.74(PE11/DFSDM_CKIN4/TIM1_CH2/SPI4_NSS/SAI2_SD_B/FMC_D8_DA8/LCD_G3/COMP_2_INP) ; port FSMC_D8
PE12: U7.75(PE12/DFSDM_DATIN5/TIM1_CH3N/SPI4_SCK/SAI2_SCK_B/FMC_D9_DA9/COMP_1_OUT/LCD_B4) ; port FSMC_D9
PE13: U7.76(PE13/DFSDM_CKIN5/TIM1_CH3/SPI4_MISO/SAI2_FS_B/FMC_D10/FMC_DA10/COMP_2_OUT/LCD_DE) ; port FSMC_D10
PE14: U7.77(PE14/TIM1_CH4/SPI4_MOSI/SAI2_MCK_B/FMC_D11_DA11/LCD_CLK) ; port FSMC_D11
PE15: U7.78(PE15/TIM1_BKIN/HDMI_TIM1_BKIN/FMC_D12_DA12/TIM1_BKIN_COMP12/LCD_R7) ; port FSMC_D12
PG6: U7.110(PG6/TIM17_BKIN/HRTIM_CHE1/QSPI_BK1_NCS/FMC_NE3/DCMI_D12/LCD_R7) ; port LTDC_R7
PG7: U7.111(PG7/HRTIM_CHE2/SAI1_MCLK_A/U6_CK/FMC_INT/DCMI_D13/LCD_CLK) ; port LTDC_CLK
PG8: U7.112(PG8/TIM8_ETR/SPI6_NSS/U6_RTS/SPDIFRX_IN2/ETH_PPS_OUT/FMC_SDCLK/LCD_G7) ; port FSMC_SDCLK
PG9: U7.152(PG9/SPI1_MISO/I2S1_SDI/SPDIFRX_IN3/U6_RX/QSPI_BK2_IO2/SAI2_FS_B/FMC_NE2_NCE/DCMI_VSYNC) ; port FSMC_NCE
PG10: U7.153(PG10/HRTIM_FLT5/SPI1_NSS/I2S1_WS/LCD_G3_B2/SAI2_SD_B/FMC_NE3/DCMI_D2) ; port FSMC_NE3
PG11: U7.154(PG11/HRTIM_EEV4/SPI1_SCK/I2S1_CK/SPDIFRX_IN0/SDMMC2_D2/ETH_MII_RMII_TX_EN/DCMI_D3/LCD_B3) ; port RMII_TX_EN
PG12: U7.155(PG12/LPT1_IN1/HRTIM_EEV5/SPI6_MISO/U6_RTS/SPDIFRX_IN1/LCD_B4/ETH_MII_RMII_TXD1/FMC_NE4/LCD_B1) U8.1(CS) ; port SPI1_CS  [also labelled SPI1_CS]
PG13: U7.156(PG13/LPT1_OUT/HRTIM_EEV10/SPI6_SCK/U6_CTS/ETH_MII_RMII_TXD0/FMC_A24/LCD_R0) ; port RMII_TXD0
PG14: U7.157(PG14/LPT1_ETR/SPI6_MOSI/U6_TX/QSPI_BK2_IO3/ETH_MII_RMII_TXD1/FMC_A25/LCD_B0) ; port RMII_TXD1
PG15: U7.160(PG15/U6_CTS/FMC_SDNCAS/DCMI_D13) ; port FSMC_SDNCAS
PH4: U7.45(PH4/I2C2_SCL/LCD_G4_G5/OTG_HS_ULPI_NXT/ADC3_INN14_INP15) ; port LTDC_G5
PH6: U7.83(PH6/TIM12_CH1/I2C2_SMBA/SPI5_SCK/ETH_MII_RXD2/FMC_SDNE1/DCMI_D8) ; port CLK_1302
PH7: U7.84(PH7/I2C3_SCL/SPI5_MISO/ETH_MII_RXD3/FMC_SDCKE1/DCMI_D9) ; port IO_1302  [project net IO_1302]
PH8: U7.85(PH8/TIM5_ETR/I2C3_SDA/FMC_D16/DCMI_HSYNC/LCD_R2) ; port SPI1_CS1
PH9: U7.86(PH9/I2C3_SMBA/TIM12_CH2/FMC_D17/DCMI_D0/LCD_R3) ; port LTDC_R3
PH10: U7.87(PH10/I2C4_SMBA/TIM5_CH1/FMC_D18/DCMI_D1/LCD_R4) ; port LTDC_R4
PH11: U7.88(PH11/I2C4_SCL/TIM5_CH2/FMC_D19/DCMI_D2/LCD_R5) ; port KEY_INT
PH12: U7.89(PH12/I2C4_SDA/TIM5_CH3/FMC_D20/DCMI_D3/LCD_R6) ; port LTDC_R6
PH13: U7.128(PH13/TIM8_CH1N/U4_TX/FDCAN1_TX/FMC_D21/LCD_G2) ; port LTDC_G2
PH14: U7.129(PH14/TIM8_CH2N/U4_RX/FDCAN1_RX/FMC_D22/DCMI_D4/LCD_G3) ; port LTDC_G3
PH15: U7.130(PH15/TIM8_CH3N/FDCAN1_TXFD_MODE/FMC_D23/DCMI_D11/LCD_G4) ; port LTDC_G4
PI0: U7.131(PI0/TIM5_CH4/SPI2_NSS/I2S2_WS/FDCAN1_RXFD_MODE/FMC_D24/DCMI_D13/LCD_G5) ; port SPI2_CS
PI1: U7.132(PI1/TIM8_BKIN2/SPI2_SCK/I2S2_CK/TIM8_BKIN2_COMP12/FMC_D25/DCMI_D8/LCD_G6) ; port SPI2_SCK
PI2: U7.133(PI2/TIM8_CH4/SPI2_MISO/I2S2_SDI/FMC_D26/DCMI_D9/LCD_G7) ; port LTDC_G7
PI3: U7.134(PI3/TIM8_ETR/SPI2_MOSI/I2S2_SDO/FMC_D27/DCMI_D10) ; port SPI2_MOSI
PI4: U7.173(PI4/TIM8_BKIN/SAI2_MCK_A/TIM8_BKIN_COMP12/FMC_NBL2/DCMI_D5/LCD_B4) ; port I2C_SCL  [project net I2C_SCL]
PI5: U7.174(PI5/TIM8_CH1/SAI2_SCK_A/FMC_NBL3/DCMI_VSYNC/LCD_B5) ; port I2C_SDA  [project net I2C_SDA]
PI6: U7.175(PI6/TIM8_CH2/SAI2_SD_A/FMC_D28/DCMI_D6/LCD_B6) ; port LTDC_B6
PI7: U7.176(PI7/TIM8_CH3/SAI2_FS_A/FMC_D29/DCMI_D7/LCD_B7) ; port LTDC_B7
PI8: U7.7(PI8/RTC_TAMP_2/RTC_TS/WKUP3) ; port TC_SCL1
PI9: U7.11(PI9/U4_RX/FDCAN1_RX/FMC_D30/LCD_VSYNC) ; port LTDC_VSYNC
PI10: U7.12(PI10/FDCAN1_RXFD_MODE/ETH_MII_RX_ER/FMC_D31/LCD_HSYNC) ; port LTDC_HSYNC
PI11: U7.13(PI11/LCD_G6/OTG_HS_ULPI_DIR/WKUP4) ; port LTDC_G6
QSPI_BK1_IO0: U7.27(PF9/TIM17_CH1N/SPI5_MOSI/SAI1_SAI4_FS_B/U7_CTS/TIM14_CH1/QSPI_BK1_IO1/ADC3_INP2) U10.5(SI(IO0))
QSPI_BK1_IO1: U7.26(PF8/TIM16_CH1N/SPI5_MISO/SAI1_SAI4_SCK_B/U7_RTS/TIM13_CH1/QSPI_BK1_IO0/ADC3_INN3_INP7) U10.2(SO(IO1))
QSPI_BK1_IO2: U7.25(PF7/TIM17_CH1/SPI5_SCK/SAI1_SAI4_MCLK_B/U7_TX/QSPI_BK1_IO2/ADC3_INP3) U10.3(~{WP}(IO2))
QSPI_BK1_IO3: U7.24(PF6/TIM16_CH1/SPI5_NSS/SAI1_SAI4_SD_B/U7_RX/QSPI_BK1_IO3/ADC3_INN4_INP8) U10.7(HOLD/RST(IO3))
RESET: C13.1 P7.5 R27.1 RST2.1 U7.31(NRST) ; port RESET
VBAT: D1.2 D2.2 U7.6(VBAT)
VBAT3V: D1.1 ; port VBAT3V
VDDA: C16.2 C17.2 R31.1 U7.39(VDDA)
NetC14_1: C14.1 U7.81(VCAP_1)
NetC15_1: C15.1 U7.125(VCAP_2)
NetC18_1: C18.1 U7.29(PH0/OSC_IN) Y1.1(OSC1)
NetC19_1: C19.1 U7.30(PH1/OSC_OUT) Y1.2(OSC2)
NetR32_1: R32.1 R33.1 U7.171(PDR_ON)
NetU9_2: U9.2 U11.C

### Notes on the sheet
- 下载端口
- (near R27) 复位
- BYPASS

### Library data of the parts
1 = CON3: Connector
C13-C20 C22-C36 = C
C21 = Cap: Capacitor; Value: 100pF; Published: 8-Jun-2000; LatestRevisionDate: 17-Jul-2002; LatestRevisionNote: Re-released for DXP Platform.; PackageReference: RAD-0.3; Publisher: Altium Limited; PackageDescription: Radial Cap, Thru-Hole; 2 Leads; 0.3 in Pin Spacing
D1 D2 = D
P7 = Header 5: Header, 5-Pin; LatestRevisionDate: 17-Jul-2002; LatestRevisionNote: Re-released for DXP Platform.; Publisher: Altium Limited
R23-R33 = R
R34 R35 = RES
U8 = W25X16: W25X16;SST25VF016;MX25L1605
U10 = W25Q128
U11 = MOFET_N
Y1 = XTAL: Crystal Oscillator; Published: 8-Jun-2000; LatestRevisionDate: 17-Jul-2002; LatestRevisionNote: Re-released for DXP Platform.; PackageReference: R38; Publisher: Altium Limited; PackageDescription: Crystal, Thru-Hole; 2 Leads; Body 3.1 x 8.2 mm (Dia.xH)

## Sheet IO_IIC.SchDoc
size A3
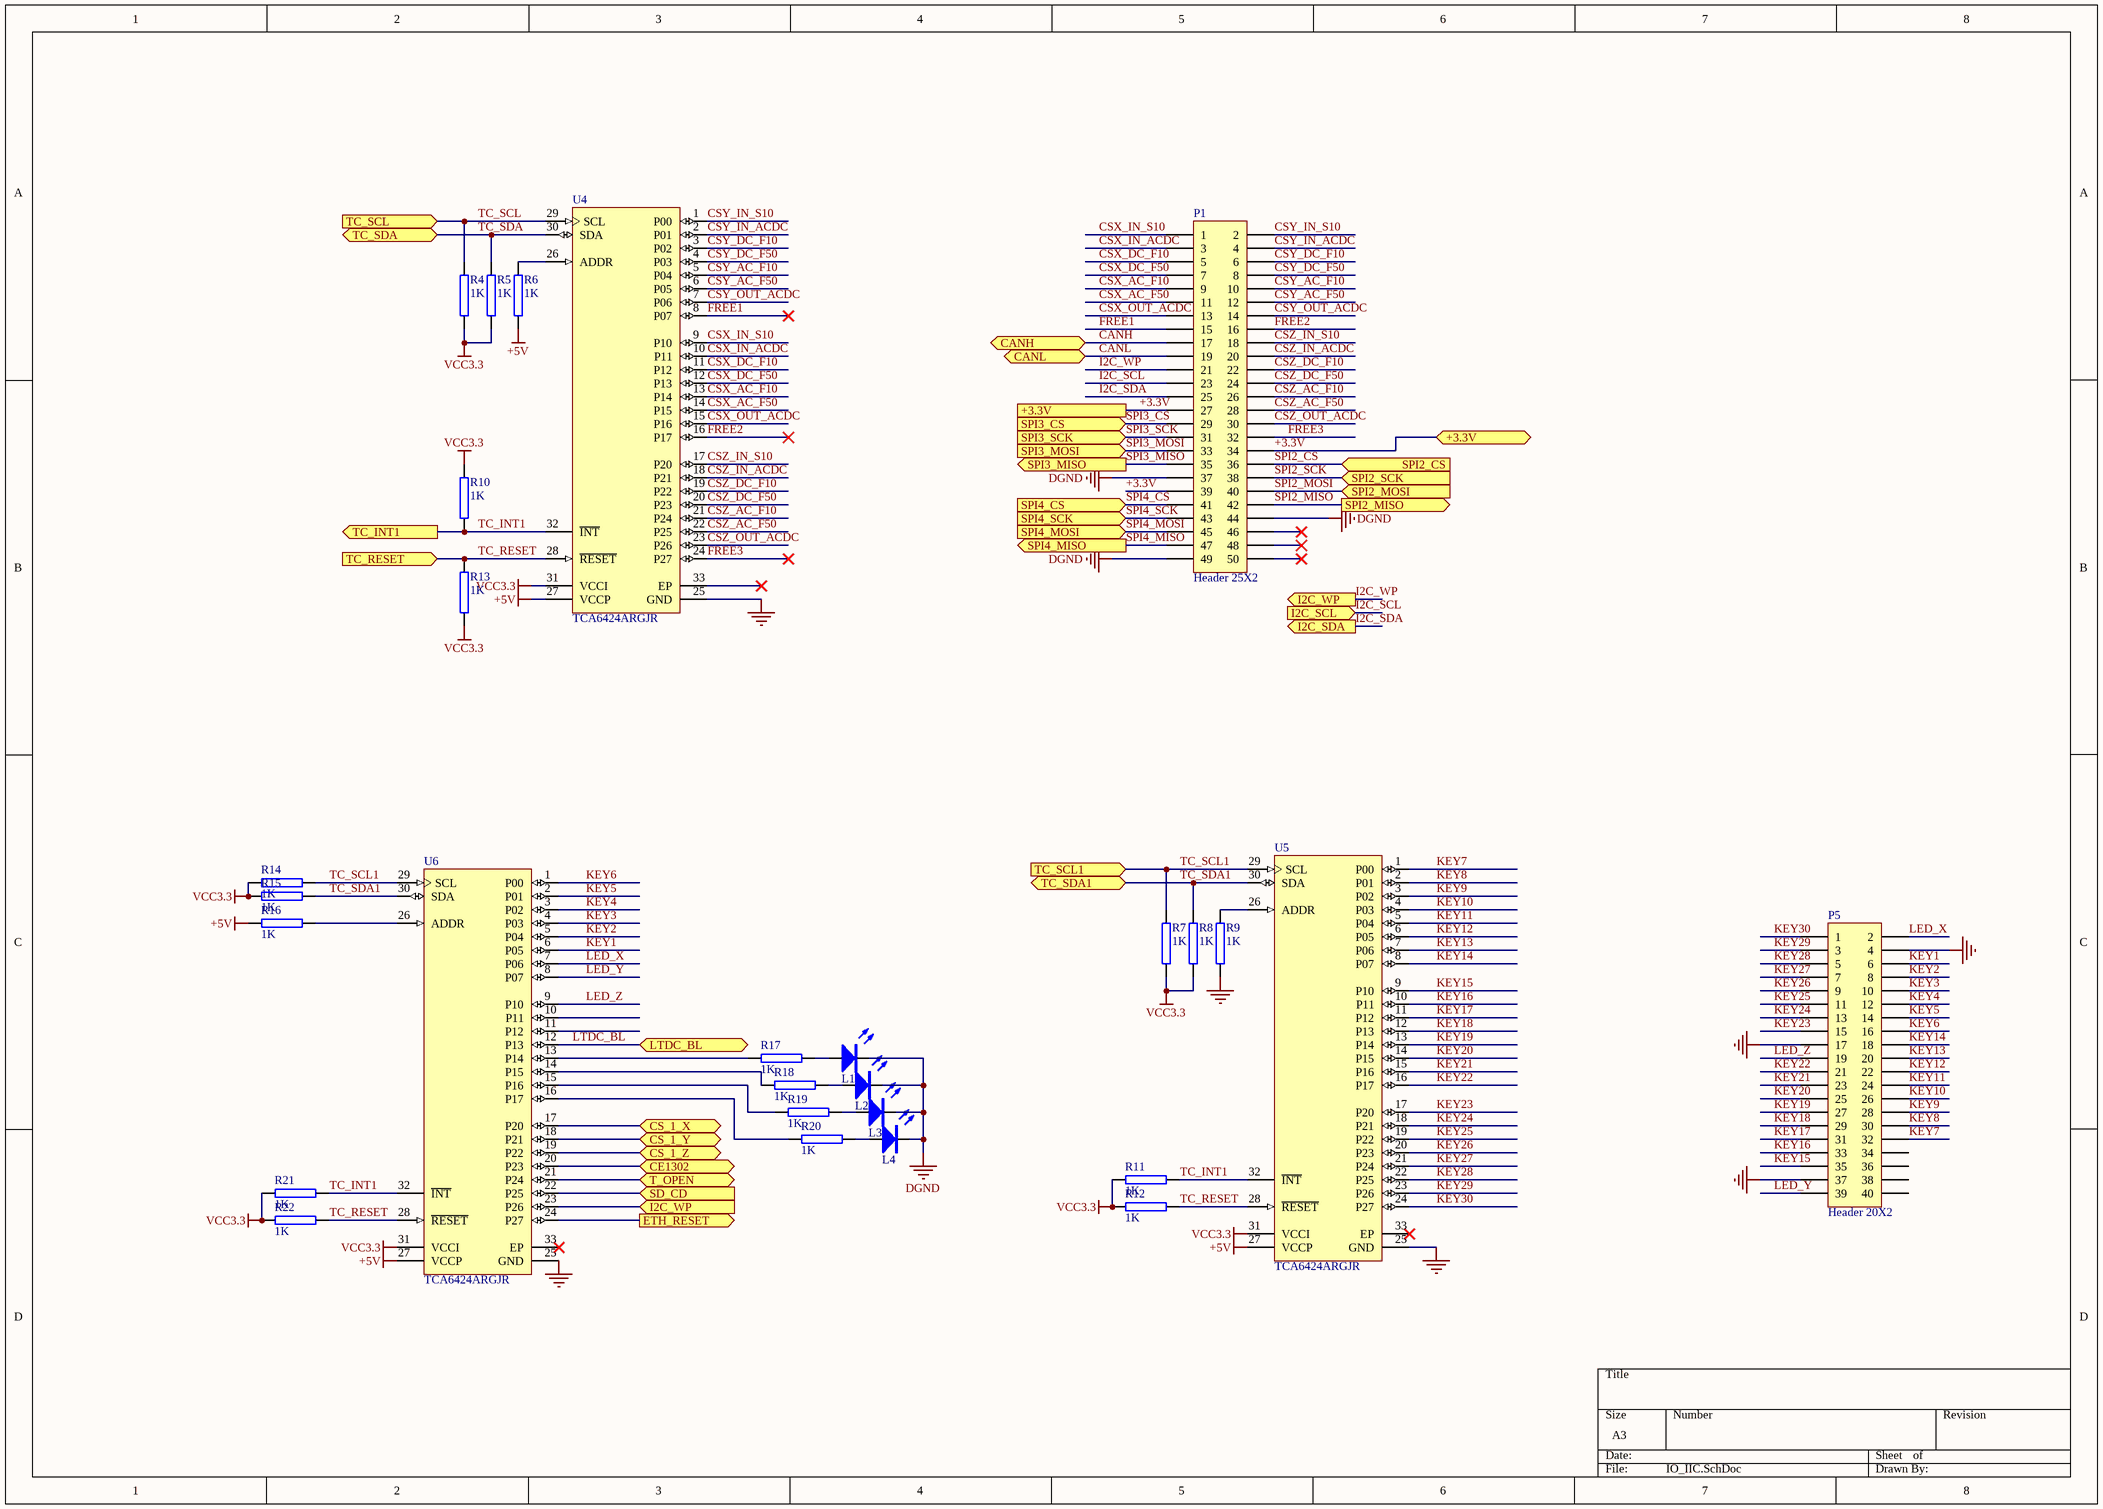
[diagram p2: IO_IIC.SchDoc]

### Parts
L1  LED  [0805LED]  (value not drawn)
L2  LED  [0805LED]  (value not drawn)
L3  LED  [0805LED]  (value not drawn)
L4  LED  [0805LED]  (value not drawn)
P1  Header 25X2  [HDR2X25]
P5  Header 20X2  [HDR2X20]
R4  1K  [0603]
R5  1K  [0603]
R6  1K  [0603]
R7  1K  [0603]
R8  1K  [0603]
R9  1K  [0603]
R10  1K  [0603]
R11  1K  [0603]
R12  1K  [0603]
R13  1K  [0603]
R14  1K  [0603]
R15  1K  [0603]
R16  1K  [0603]
R17  1K  [0603]
R18  1K  [0603]
R19  1K  [0603]
R20  1K  [0603]
R21  1K  [0603]
R22  1K  [0603]
U4  TCA6424ARGJR  [TCA6424A-QFN32]
U5  TCA6424ARGJR  [TCA6424A-QFN32]
U6  TCA6424ARGJR  [TCA6424A-QFN32]

### Ports
+3.3V, CANH, CANL, CE1302 (bidir), CS_1_X (bidir), CS_1_Y (bidir), CS_1_Z (bidir), ETH_RESET (out), I2C_SCL (in), I2C_SDA (out), I2C_WP (in), I2C_WP (out), LTDC_BL, SD_CD (in), SPI2_CS (in), SPI2_MISO (out), SPI2_MOSI (in), SPI2_SCK (in), SPI3_CS (in), SPI3_MISO (out), SPI3_MOSI (in), SPI3_SCK (in), SPI4_CS (in), SPI4_MISO (out), SPI4_MOSI (in), SPI4_SCK (in), T_OPEN (bidir), TC_INT1 (out), TC_RESET (in), TC_SCL1 (in), TC_SCL (in), TC_SDA1 (bidir), TC_SDA (bidir)

### Nets
+5V: R6.2 R16.2 U4.27(VCCP) U5.27(VCCP) U6.27(VCCP)
DGND: L1.2(K) L2.2(K) L3.2(K) L4.2(K) P1.37 P1.44 P1.49 P5.4 P5.17 P5.37 R9.2 U4.25(GND) U5.25(GND) U6.25(GND)
VCC3.3: R4.2 R5.2 R7.2 R8.2 R10.2 R11.2 R12.2 R13.1 R14.2 R15.2 R21.2 R22.2 U4.31(VCCI) U5.31(VCCI) U6.31(VCCI)
+3.3V: P1.27 P1.34 P1.39 ; port +3.3V
CANH: P1.17 ; port CANH
CANL: P1.19 ; port CANL
CS_1_X: U6.17(P20) ; port CS_1_X
CS_1_Y: U6.18(P21) ; port CS_1_Y
CS_1_Z: U6.19(P22) ; port CS_1_Z
CSX_AC_F10: P1.9 U4.13(P14)
CSX_AC_F50: P1.11 U4.14(P15)
CSX_DC_F10: P1.5 U4.11(P12)
CSX_DC_F50: P1.7 U4.12(P13)
CSX_IN_ACDC: P1.3 U4.10(P11)
CSX_IN_S10: P1.1 U4.9(P10)
CSX_OUT_ACDC: P1.13 U4.15(P16)
CSY_AC_F10: P1.10 U4.5(P04)
CSY_AC_F50: P1.12 U4.6(P05)
CSY_DC_F10: P1.6 U4.3(P02)
CSY_DC_F50: P1.8 U4.4(P03)
CSY_IN_ACDC: P1.4 U4.2(P01)
CSY_IN_S10: P1.2 U4.1(P00)
CSY_OUT_ACDC: P1.14 U4.7(P06)
CSZ_AC_F10: P1.26 U4.21(P24)
CSZ_AC_F50: P1.28 U4.22(P25)
CSZ_DC_F10: P1.22 U4.19(P22)
CSZ_DC_F50: P1.24 U4.20(P23)
CSZ_IN_ACDC: P1.20 U4.18(P21)
CSZ_IN_S10: P1.18 U4.17(P20)
CSZ_OUT_ACDC: P1.30 U4.23(P26)
ETH_RESET: U6.24(P27) ; port ETH_RESET
FREE1: P1.15 U4.8(P07)
FREE2: P1.16 U4.16(P17)
FREE3: P1.32 U4.24(P27)
I2C_SCL: P1.23 ; port I2C_SCL
I2C_SDA: P1.25 ; port I2C_SDA
I2C_WP: P1.21 U6.23(P26) ; port I2C_WP
KEY1: P5.6 U6.6(P05)
KEY2: P5.8 U6.5(P04)
KEY3: P5.10 U6.4(P03)
KEY4: P5.12 U6.3(P02)
KEY5: P5.14 U6.2(P01)
KEY6: P5.16 U6.1(P00)
KEY7: P5.32 U5.1(P00)
KEY8: P5.30 U5.2(P01)
KEY9: P5.28 U5.3(P02)
KEY10: P5.26 U5.4(P03)
KEY11: P5.24 U5.5(P04)
KEY12: P5.22 U5.6(P05)
KEY13: P5.20 U5.7(P06)
KEY14: P5.18 U5.8(P07)
KEY15: P5.35 U5.9(P10)
KEY16: P5.33 U5.10(P11)
KEY17: P5.31 U5.11(P12)
KEY18: P5.29 U5.12(P13)
KEY19: P5.27 U5.13(P14)
KEY20: P5.25 U5.14(P15)
KEY21: P5.23 U5.15(P16)
KEY22: P5.21 U5.16(P17)
KEY23: P5.15 U5.17(P20)
KEY24: P5.13 U5.18(P21)
KEY25: P5.11 U5.19(P22)
KEY26: P5.9 U5.20(P23)
KEY27: P5.7 U5.21(P24)
KEY28: P5.5 U5.22(P25)
KEY29: P5.3 U5.23(P26)
KEY30: P5.1 U5.24(P27)
LED_X: P5.2 U6.7(P06)
LED_Y: P5.39 U6.8(P07)
LED_Z: P5.19 U6.9(P10)
LTDC_BL: U6.12(P13) ; port LTDC_BL
SPI2_CS: P1.36 ; port SPI2_CS  [project net PI0]
SPI2_MISO: P1.42 ; port SPI2_MISO  [project net PB14]
SPI2_MOSI: P1.40 ; port SPI2_MOSI  [project net PI3]
SPI2_SCK: P1.38 ; port SPI2_SCK  [project net PI1]
SPI3_CS: P1.29 ; port SPI3_CS  [project net PB5]
SPI3_MISO: P1.35 ; port SPI3_MISO  [project net PB4]
SPI3_MOSI: P1.33 ; port SPI3_MOSI  [project net PD6]
SPI3_SCK: P1.31 ; port SPI3_SCK  [project net PB3]
SPI4_CS: P1.41 ; port SPI4_CS  [project net PE4]
SPI4_MISO: P1.47 ; port SPI4_MISO  [project net PE5]
SPI4_MOSI: P1.45 ; port SPI4_MOSI  [project net PE6]
SPI4_SCK: P1.43 ; port SPI4_SCK  [project net PE2]
TC_INT1: R10.1 R11.1 R21.1 U4.32(~{INT}) U5.32(~{INT}) U6.32(~{INT}) ; port TC_INT1  [project net PC13]
TC_RESET: R12.1 R13.2 R22.1 U4.28(~{RESET}) U5.28(~{RESET}) U6.28(~{RESET}) ; port TC_RESET  [project net PE3]
TC_SCL: R4.1 U4.29(SCL) ; port TC_SCL  [project net PC14]
TC_SCL1: R7.1 R14.1 U5.29(SCL) U6.29(SCL) ; port TC_SCL1  [project net PI8]
TC_SDA: R5.1 U4.30(SDA) ; port TC_SDA  [project net PC15]
TC_SDA1: R8.1 R15.1 U5.30(SDA) U6.30(SDA) ; port TC_SDA1  [project net PA15]
NetL1_1: L1.1(A) R17.1
NetL2_1: L2.1(A) R18.1
NetL3_1: L3.1(A) R19.1
NetL4_1: L4.1(A) R20.1
NetP100_9: U6.22(P25) ; port SD_CD
NetR6_1: R6.1 U4.26(ADDR)
NetR9_1: R9.1 U5.26(ADDR)
NetR16_1: R16.1 U6.26(ADDR)
NetR17_2: R17.2 U6.13(P14)
NetR18_2: R18.2 U6.14(P15)
NetR19_2: R19.2 U6.15(P16)
NetR20_2: R20.2 U6.16(P17)
NetU6_20: U6.20(P23) ; port CE1302
NetU6_21: U6.21(P24) ; port T_OPEN

Not connected (* = marked no-connect by the designer): P1 46* 48* 50*; P5 34 36 38 40; U4 33(EP)*; U5 33(EP)*; U6 10(P11) 11(P12) 33(EP)*

### Library data of the parts
P1 = Header 25X2: Header, 25-Pin, Dual row; LatestRevisionDate: 17-Jul-2002; LatestRevisionNote: Re-released for DXP Platform.; Publisher: Altium Limited
P5 = Header 20X2: Header, 20-Pin, Dual row; LatestRevisionDate: 17-Jul-2002; LatestRevisionNote: Re-released for DXP Platform.; Publisher: Altium Limited
R4-R22 = RES
U4-U6 = TCA6424ARGJR: Low-Voltage 24-Bit I2C and SMBus I/O Expander, 24 Outputs, 1.65 to 5.5 V, -40 to 85 degC, 32-pin UQFN (RGJ), Green (RoHS & no Sb/Br); Manufacturer: Texas Instruments; SubFamily: I2C IO Expander; No. of Outputs: 24; Interrupt Output: Yes; VCC(Min)(V): 1.65; VCC(Max)(V): 5.5; Max Frequency(kHz): 400; I2C Address: 0100 01x; DatasheetVersion: SCPS193B; PackageVersion: revD, Apr-2011; PackageReference: RGJ32-3150X3150TP; PackageDescription: 32-Pin Plastic Quad Flatpack No-Lead, 5 x 5 mm Body, 0.5 mm Pitch; Supplier 1: Digi-Key; Supplier Part Number 1: 296-27844-2-ND; Supplier 2: Digi-Key; Supplier Part Number 2: 296-27844-1-ND; Supplier 3: Digi-Key; Supplier Part Number 3: 296-27844-6-ND; Supplier 4: Farnell; Supplier Part Number 4: 1863866; Supplier 5: Newark; Supplier Part Number 5: 01T0713; Supplier 6: Mouser; Supplier Part Number 6: 595-TCA6424ARGJR; Eco-Plan: Green (RoHS & no Sb/Br); Reset Input: Yes; # of I/Os: 24; Vcc range(V): 1.65 to 5.5; Low Power: Yes; Configuration Registers: Yes; 5V Tolerant I/O: Yes; Push-Pull I/O Type: Yes; Mounting Technology: Surface Mount; PartNumber: TCA6424ARGJR; Code_JEDEC: MO-248-UHHD-1*; ComponentLink1Description: Datasheet; ComponentLink1URL: http://www.ti.com/general/docs/lit/getliterature.tsp?genericPartNumber=TCA6424A&fileType=pdf; ComponentLink2Description: Package Specification; ComponentLink2URL: http://www.ti.com/litv/pdf/mpqf183c

## Sheet Power.SchDoc
size A3
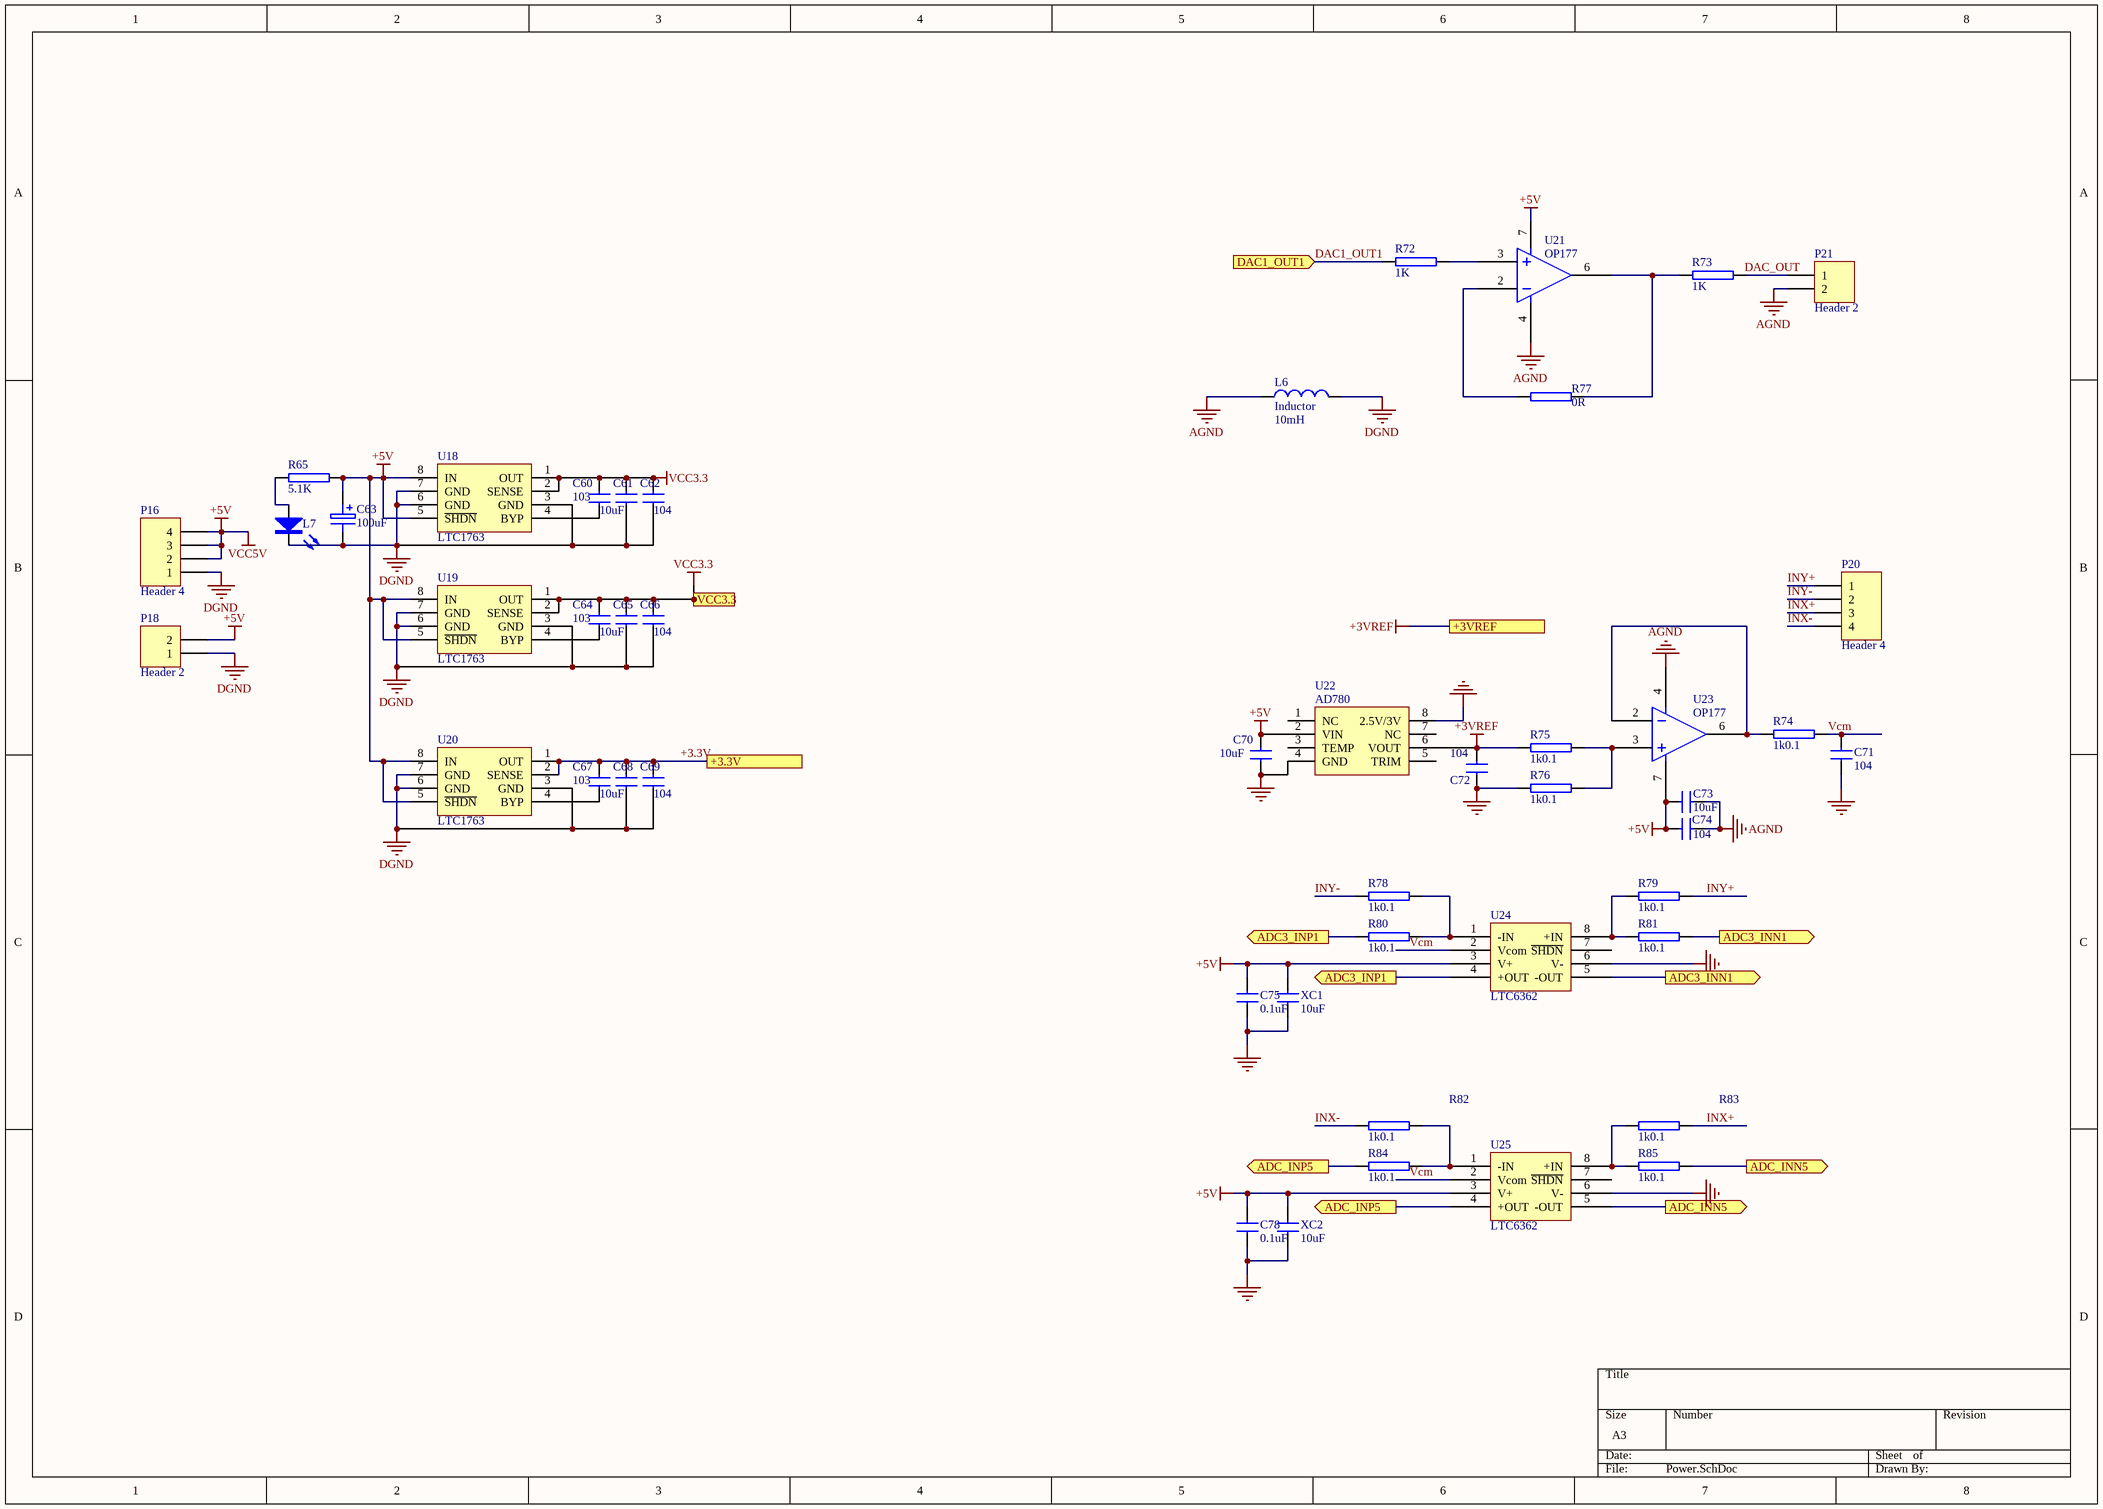
[diagram p3: Power.SchDoc]

### Parts
C60  103  [0603]
C61  10uF  [0603]
C62  104  [0603]
C63  100uF  [100UF/25V_CA]
C64  103  [0603]
C65  10uF  [0603]
C66  104  [0603]
C67  103  [0603]
C68  10uF  [0603]
C69  104  [0603]
C70  10uF  [0603]
C71  104  [0603]
C72  104  [0603]
C73  10uF  [0603]
C74  104  [0603]
C75  0.1uF  [0603]
C78  0.1uF  [0603]
L6  Inductor  value 10mH  [0805]
L7  LED  [0805LED]  (value not drawn)
P16  Header 4  [HDR1X4]
P18  Header 2  [HDR1X2]
P20  Header 4  [HDR1X4]
P21  Header 2  [HDR1X2]
R65  5.1K  [0603]
R72  1K  [0603]
R73  1K  [0603]
R74  1k0.1  [0603]
R75  1k0.1  [0603]
R76  1k0.1  [0603]
R77  0R  [0603]
R78  1k0.1  [0603]
R79  1k0.1  [0603]
R80  1k0.1  [0603]
R81  1k0.1  [0603]
R82  1k0.1  [0603]
R83  1k0.1  [0603]
R84  1k0.1  [0603]
R85  1k0.1  [0603]
U18  LTC1763  [SO-8]
U19  LTC1763  [SO-8]
U20  LTC1763  [SO-8]
U21  OP177  [SO-8]
U22  AD780  [SO-8]
U23  OP177  [SO-8]
U24  LTC6362  [LT6350XIN]
U25  LTC6362  [LT6350XIN]
XC1  10uF  [0603]
XC2  10uF  [0603]

### Ports
+3.3V, +3VREF, ADC3_INN1 (out), ADC3_INP1 (out), ADC_INN5 (out), ADC_INP5 (out), DAC1_OUT1 (in), VCC3.3

### Nets
+3VREF: C72.2 R75.1 U22.6(VOUT) ; port +3VREF  [project net VREF+]
+5V: C63.1 C70.1 C73.2 C74.2 C75.2 C78.2 P16.2 P16.3 P16.4 P18.2 R65.1 U18.5(~{SHDN}) U18.8(IN) U19.5(~{SHDN}) U19.8(IN) U20.5(~{SHDN}) U20.8(IN) U21.7 U22.2(VIN) U23.7 U24.3(V+) U25.3(V+) XC1.1 XC2.1  [also labelled VCC5V]
AGND: C70.2 C71.2 C72.1 C73.1 C74.1 C75.1 C78.1 L6.1 P21.2 R76.1 U21.4 U22.4(GND) U22.8(2.5V/3V) U23.4 U24.6(V-) U25.6(V-) XC1.2 XC2.2
DGND: C61.2 C62.2 C63.2 C65.2 C66.2 C68.2 C69.2 L6.2 L7.2(K) P16.1 P18.1 U18.3(GND) U18.6(GND) U18.7(GND) U19.3(GND) U19.6(GND) U19.7(GND) U20.3(GND) U20.6(GND) U20.7(GND)
VCC3.3: C60.1 C61.1 C62.1 C64.1 C65.1 C66.1 U18.1(OUT) U18.2(SENSE) U19.1(OUT) U19.2(SENSE) ; port VCC3.3
+3.3V: C67.1 C68.1 C69.1 U20.1(OUT) U20.2(SENSE) ; port +3.3V
DAC1_OUT1: R72.2 ; port DAC1_OUT1
INX+: P20.3 R83.2
INX-: P20.4 R82.2
INY+: P20.1 R79.2
INY-: P20.2 R78.2
PB0: R85.2 U25.5(-OUT) ; port ADC_INN5
PB1: R84.1 U25.4(+OUT) ; port ADC_INP5
PC2: R81.2 U24.5(-OUT) ; port ADC3_INN1
PC3: R80.1 U24.4(+OUT) ; port ADC3_INP1
Vcm: C71.1 R74.2 U24.2(Vcom) U25.2(Vcom)
NetC60_2: C60.2 U18.4(BYP)
NetC64_2: C64.2 U19.4(BYP)
NetC67_2: C67.2 U20.4(BYP)
NetL7_1: L7.1(A) R65.2
NetP21_1: P21.1 R73.1
NetR72_1: R72.1 U21.3
NetR73_2: R73.2 R77.1 U21.6
NetR74_1: R74.1 U23.2 U23.6
NetR75_2: R75.2 R76.2 U23.3
NetR77_2: R77.2 U21.2
NetR78_1: R78.1 R80.2 U24.1(-IN)
NetR79_1: R79.1 R81.1 U24.8(+IN)
NetR82_1: R82.1 R84.2 U25.1(-IN)
NetR83_1: R83.1 R85.1 U25.8(+IN)

Not connected (* = marked no-connect by the designer): U22 1(NC) 3(TEMP) 5(TRIM) 7(NC); U24 7(~{SHDN}); U25 7(~{SHDN})

### Notes on the sheet
- Labels drawn without touching a wire or pin: DAC_OUT

### Library data of the parts
C60-C62 C64-C75 C78 XC1 XC2 = C
C63 = ELECTRO1
L6 = Inductor: Code_IEC: 1005; Published: 8-Jun-2000; LatestRevisionDate: 29-May-2009; LatestRevisionNote: IPC-7351 Footprint Added.; PackageReference: 0402-A; Publisher: Altium Limited; PackageDescription: Chip Inductor; Code_JEITA: 0402
P16 P20 = Header 4: Header, 4-Pin; LatestRevisionDate: 17-Jul-2002; LatestRevisionNote: Re-released for DXP Platform.; Publisher: Altium Limited
P18 P21 = Header 2: Header, 2-Pin; LatestRevisionDate: 17-Jul-2002; LatestRevisionNote: Re-released for DXP Platform.; Publisher: Altium Limited
R65 R72-R85 = RES
U18-U20 = LT1763
U21 U23 = LM207
U24 U25 = LTC6362: SAR ADC Drive

## Nets that join several sheets
+5V: IO_IIC (5 pins), Power (24 pins)
DGND: MCU_Per (48 pins), MCU_H (47 pins), IO_IIC (14 pins), Power (20 pins)
VCC3.3: MCU_H (R25.1 R28.1), IO_IIC (15 pins), Power (10 pins)
VCC3.3D: MCU_Per (25 pins), MCU_H (48 pins)
VREF+: MCU_H (U7.38), Power (C72.2 R75.1 U22.6)
+3.3V: IO_IIC (P1.27 P1.34 P1.39), Power (5 pins)
CAN1_RX: MCU_Per (U15.4), MCU_H (U7.167)
CAN1_TX: MCU_Per (U15.1), MCU_H (U7.168)
CANH: MCU_Per (R45.1 U15.7), IO_IIC (P1.17)
CANL: MCU_Per (R45.2 U15.6), IO_IIC (P1.19)
DAC1_OUT1: MCU_H (U7.50), Power (R72.2)
ETH_MDC: MCU_Per (U16.13), MCU_H (U7.33)
ETH_MDIO: MCU_Per (R46.2), MCU_H (U7.42)
ETH_RESET: MCU_Per (R58.1 U16.15), IO_IIC (U6.24)
I2C_SCL: MCU_Per (R53.1 U17.6), MCU_H (U7.173), IO_IIC (P1.23)
I2C_SDA: MCU_Per (R54.1 U17.5), MCU_H (U7.174), IO_IIC (P1.25)
I2C_WP: MCU_Per (R52.1 U17.7), IO_IIC (P1.21 U6.23)
IO_1302: MCU_Per (R41.1 U13.6), MCU_H (U7.84)
NetP100_9: MCU_Per (P100.9 R86.1), IO_IIC (U6.22)
PA7: MCU_Per (U16.11), MCU_H (U7.53)
PA9: MCU_Per (U14.13), MCU_H (U7.120)
PA11: MCU_Per (R42.1), MCU_H (U7.122)
PA12: MCU_Per (R40.1), MCU_H (U7.123)
PA15: MCU_H (U7.138), IO_IIC (R8.1 R15.1 U5.30 U6.30)
PA100: MCU_Per (U16.14), MCU_H (U7.41)
PB0: MCU_H (U7.56), Power (R85.2 U25.5)
PB1: MCU_H (U7.57), Power (R84.1 U25.4)
PB3: MCU_H (U7.161), IO_IIC (P1.31)
PB4: MCU_H (U7.162), IO_IIC (P1.35)
PB5: MCU_H (U7.163), IO_IIC (P1.29)
PB10: MCU_Per (P9.5), MCU_H (U7.79)
PB11: MCU_Per (P9.6), MCU_H (U7.80)
PB12: MCU_Per (U14.8), MCU_H (U7.92)
PB13: MCU_Per (U14.7), MCU_H (U7.93)
PB14: MCU_H (U7.94), IO_IIC (P1.42)
PB15: MCU_Per (U14.14), MCU_H (U7.95)
PC2: MCU_H (U7.34), Power (R81.2 U24.5)
PC3: MCU_H (U7.35), Power (R80.1 U24.4)
PC4: MCU_Per (U16.8), MCU_H (U7.54)
PC5: MCU_Per (U16.7), MCU_H (U7.55)
PC8: MCU_Per (P100.7 R43.1), MCU_H (U7.117)
PC9: MCU_Per (P100.8 R44.1), MCU_H (U7.118)
PC10: MCU_Per (P100.1 R39.2), MCU_H (U7.139)
PC11: MCU_Per (P100.2 R38.2), MCU_H (U7.140)
PC12: MCU_Per (P100.5), MCU_H (U7.141)
PC13: MCU_H (U7.8), IO_IIC (6 pins)
PC14: MCU_H (U7.9), IO_IIC (R4.1 U4.29)
PC15: MCU_H (U7.10), IO_IIC (R5.1 U4.30)
PD2: MCU_Per (P100.3 R37.2), MCU_H (U7.144)
PD6: MCU_H (U7.150), IO_IIC (P1.33)
PE2: MCU_H (U7.1), IO_IIC (P1.43)
PE3: MCU_H (U7.2), IO_IIC (6 pins)
PE4: MCU_H (U7.3), IO_IIC (P1.41)
PE5: MCU_H (U7.4), IO_IIC (P1.47)
PE6: MCU_H (U7.5), IO_IIC (P1.45)
PG11: MCU_Per (U16.16), MCU_H (U7.154)
PG13: MCU_Per (U16.17), MCU_H (U7.156)
PG14: MCU_Per (U16.18), MCU_H (U7.157)
PH6: MCU_Per (U13.7), MCU_H (U7.83)
PI0: MCU_H (U7.131), IO_IIC (P1.36)
PI1: MCU_H (U7.132), IO_IIC (P1.38)
PI3: MCU_H (U7.134), IO_IIC (P1.40)
PI8: MCU_H (U7.7), IO_IIC (R7.1 R14.1 U5.29 U6.29)
VBAT3V: MCU_Per (BAT1.1 U13.8), MCU_H (D1.1)